# Altium project PowCapMobile.PrjPCB (part 1 of 3)
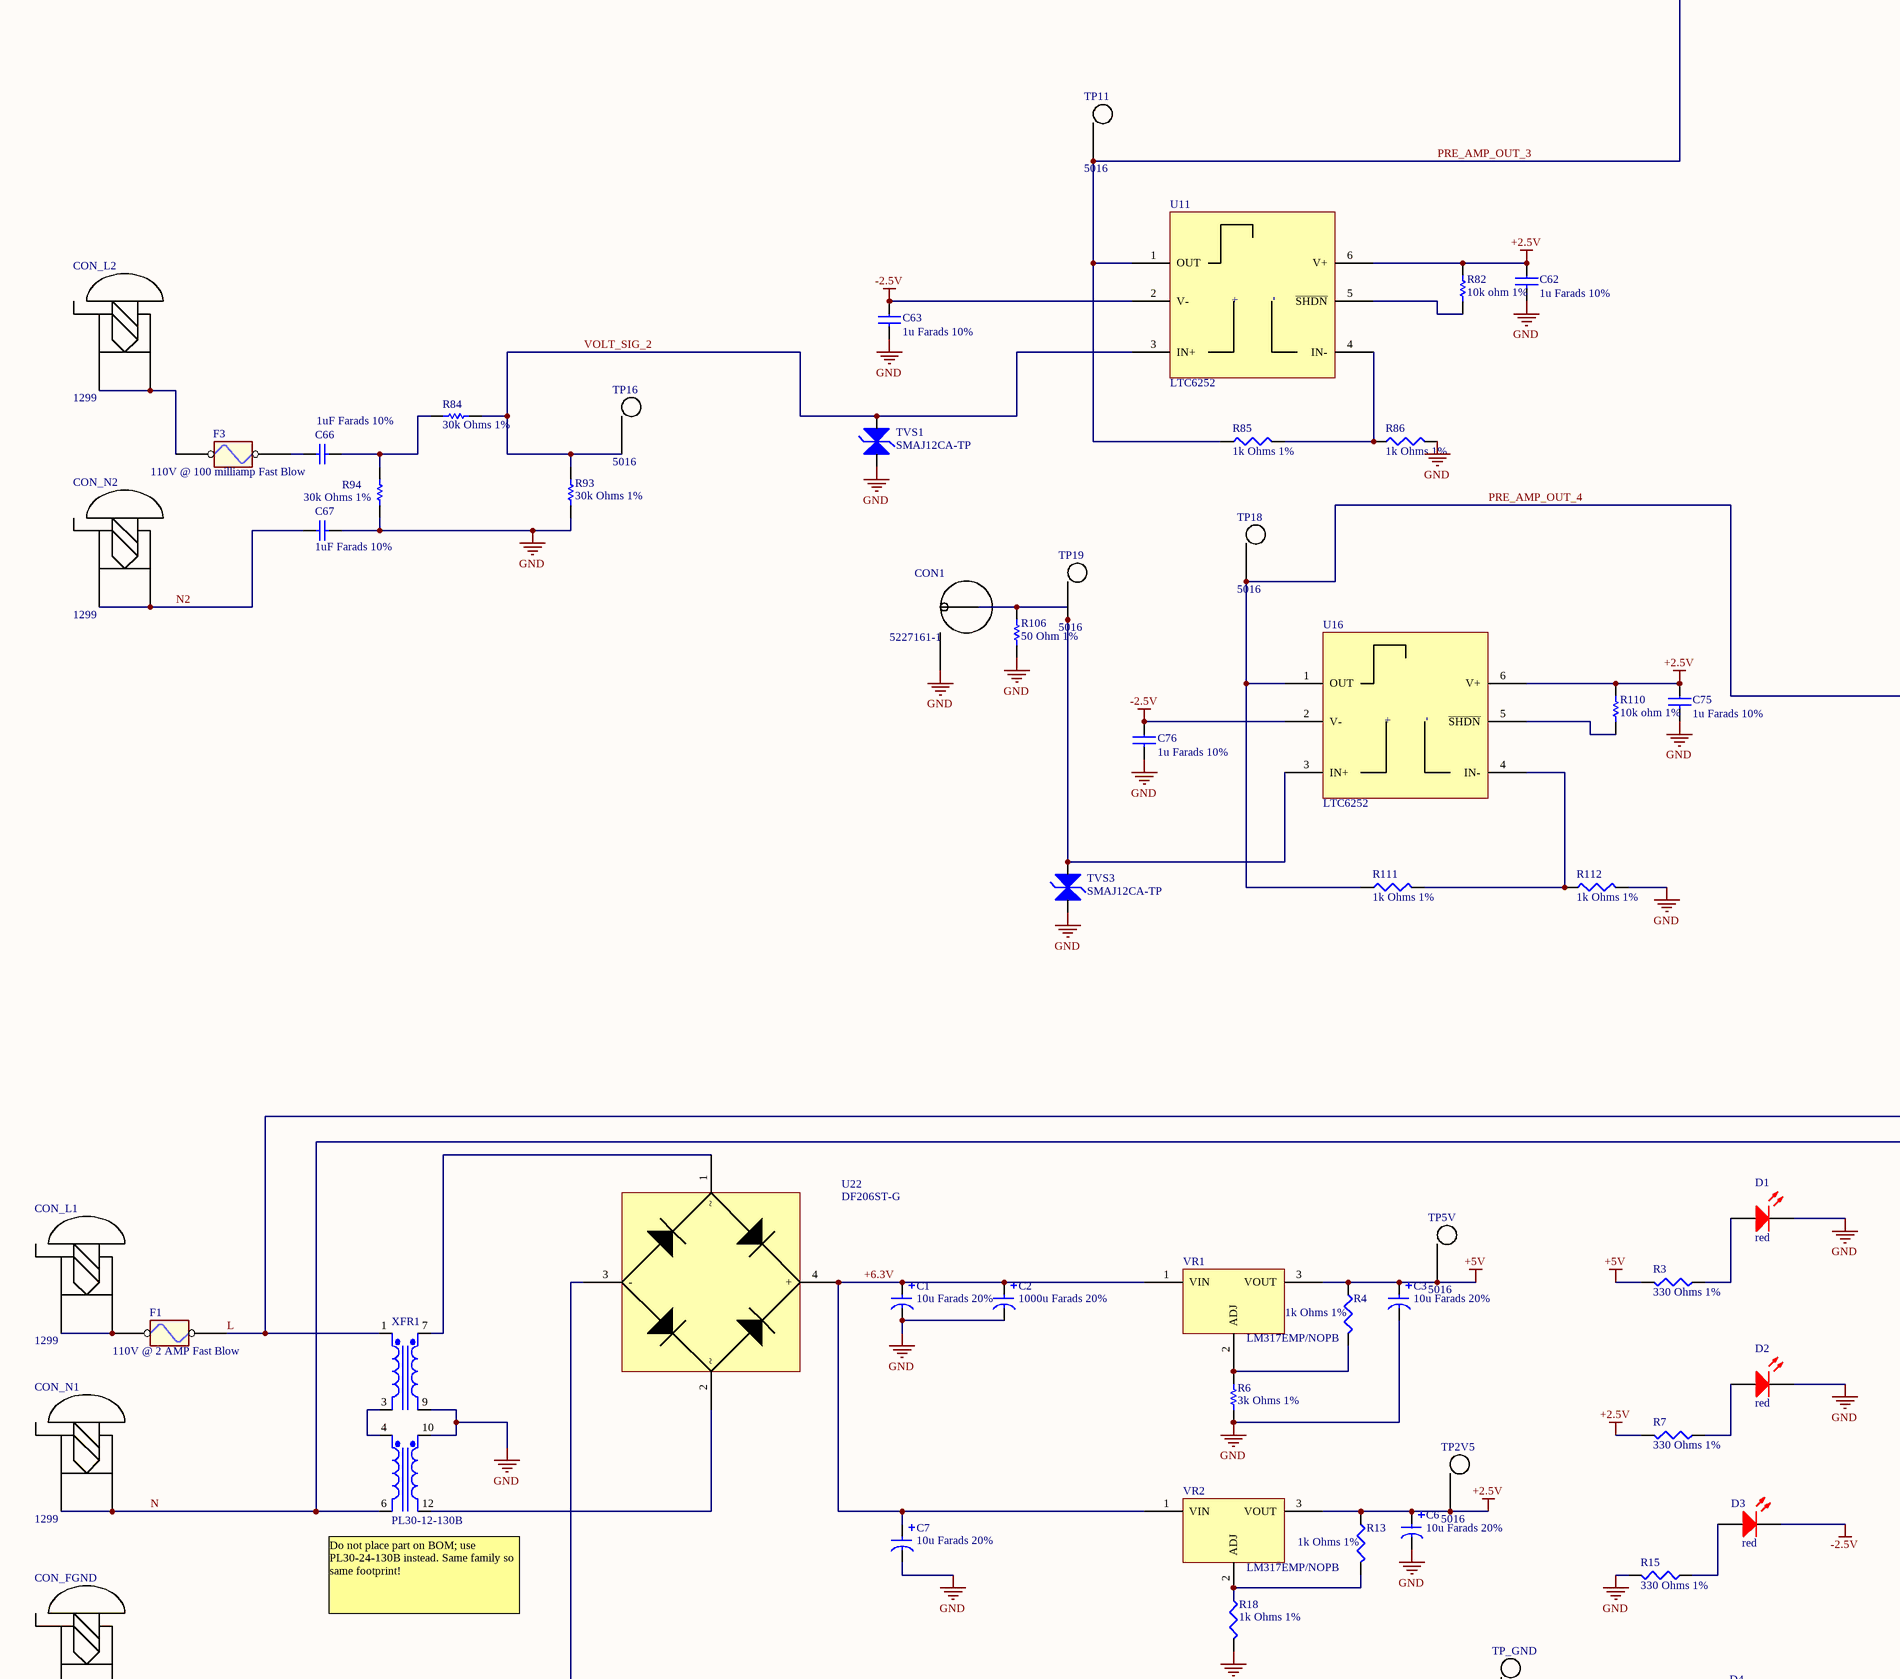
[diagram p0: PowCapMobile.SchDoc, top left]
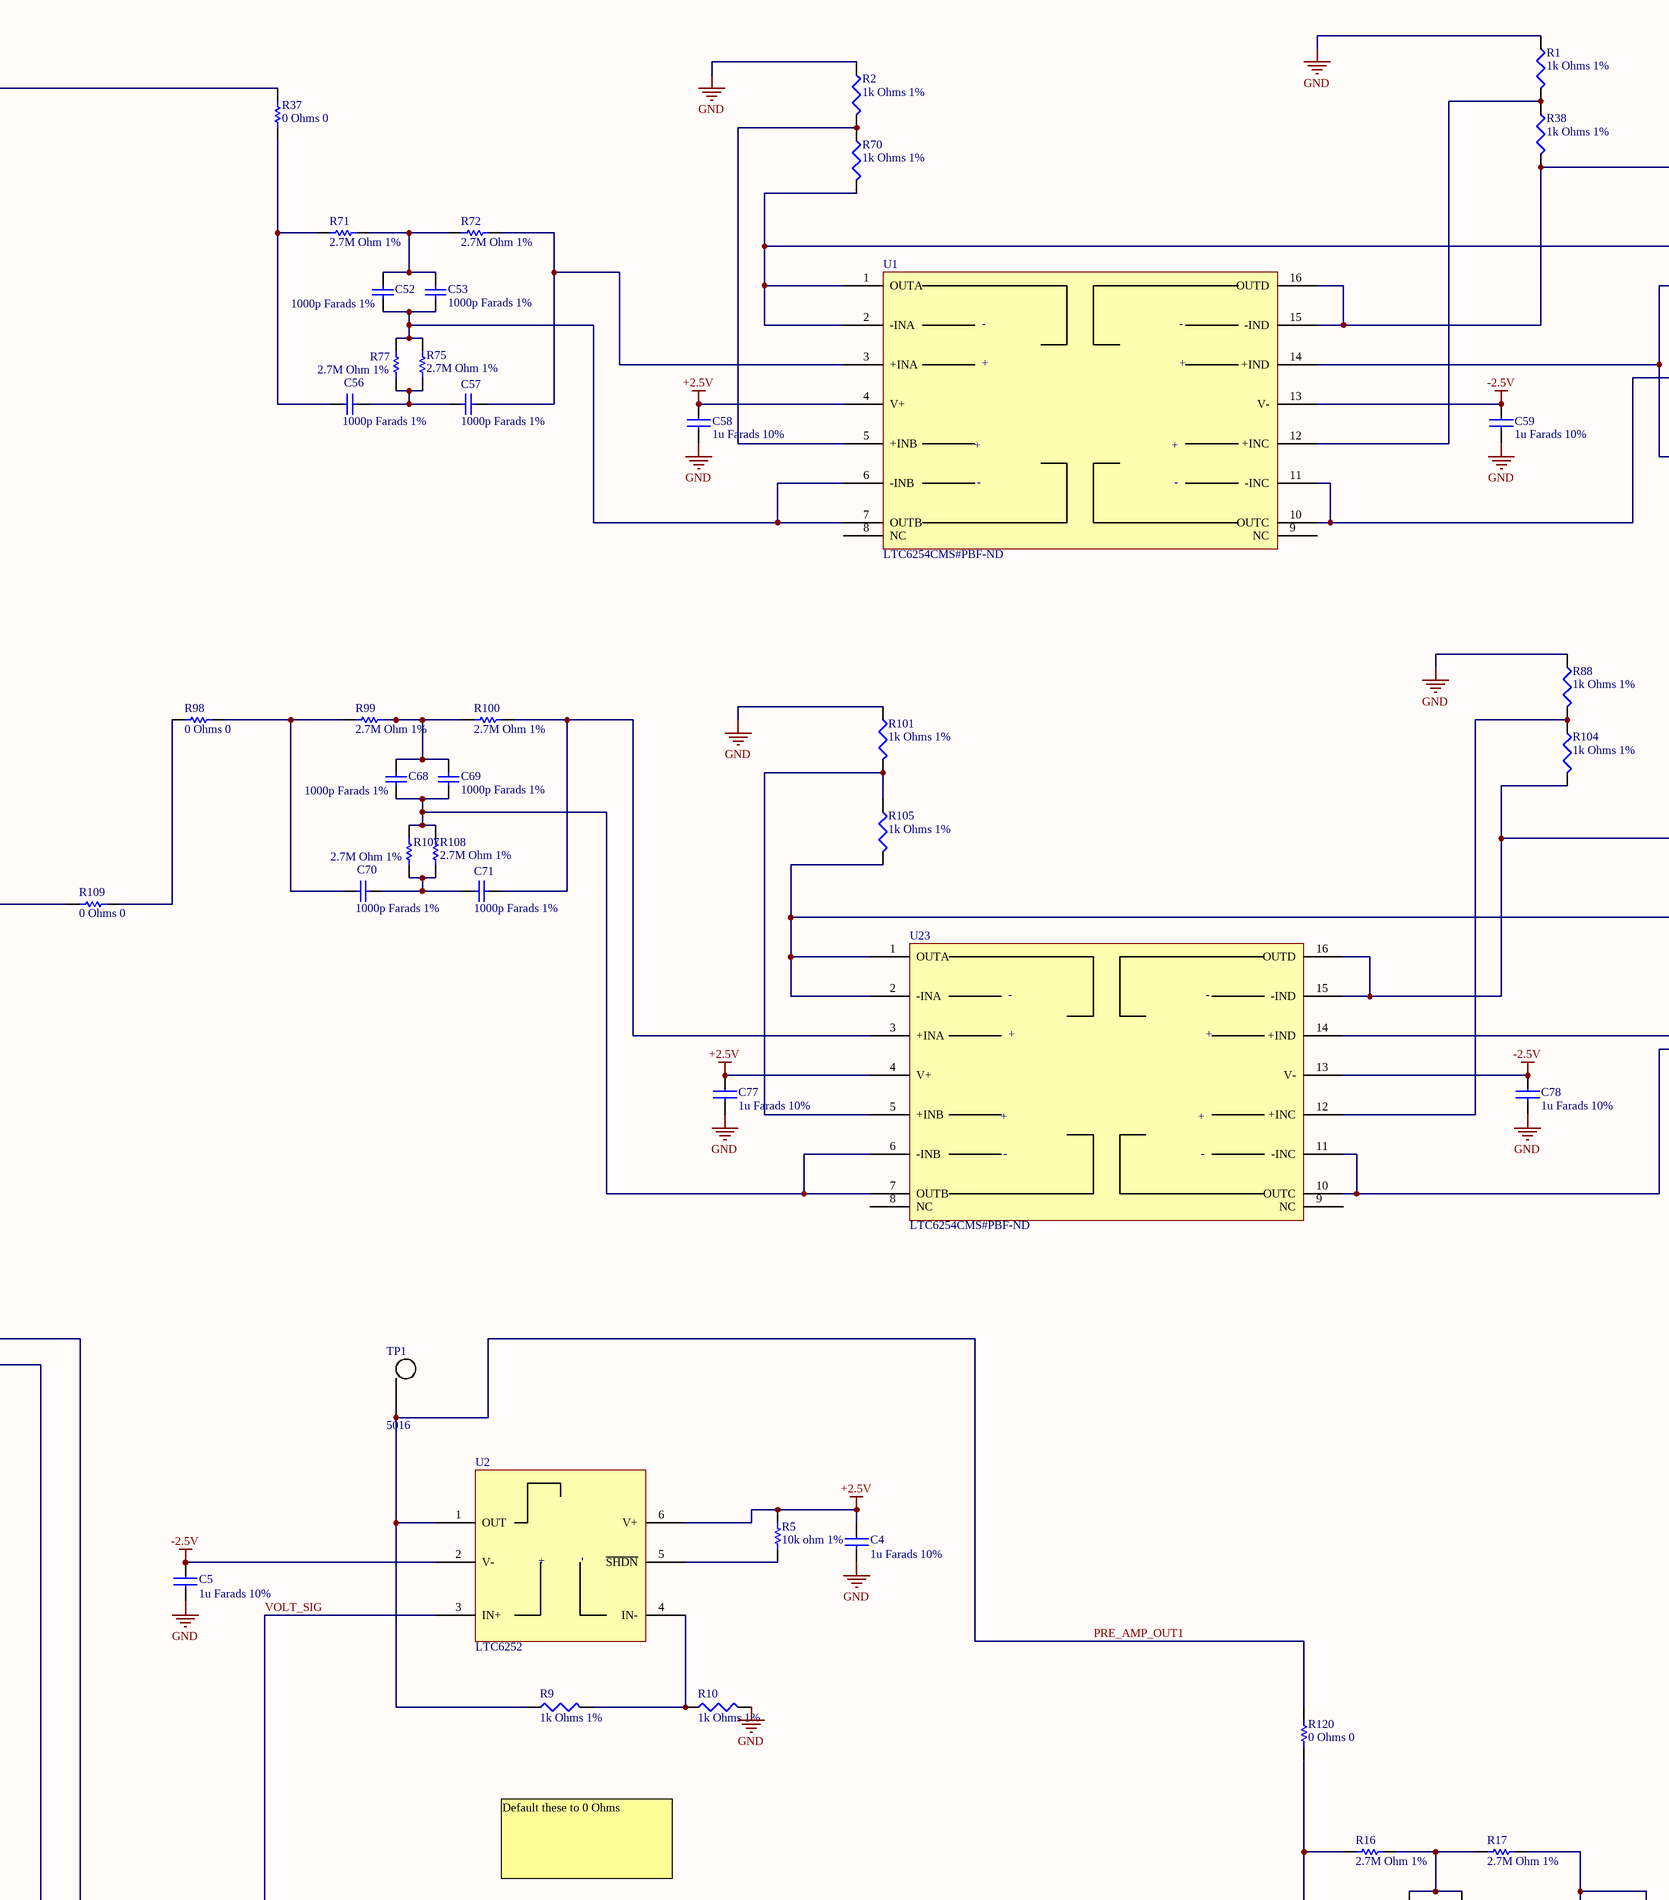
[diagram p1: PowCapMobile.SchDoc, top middle]
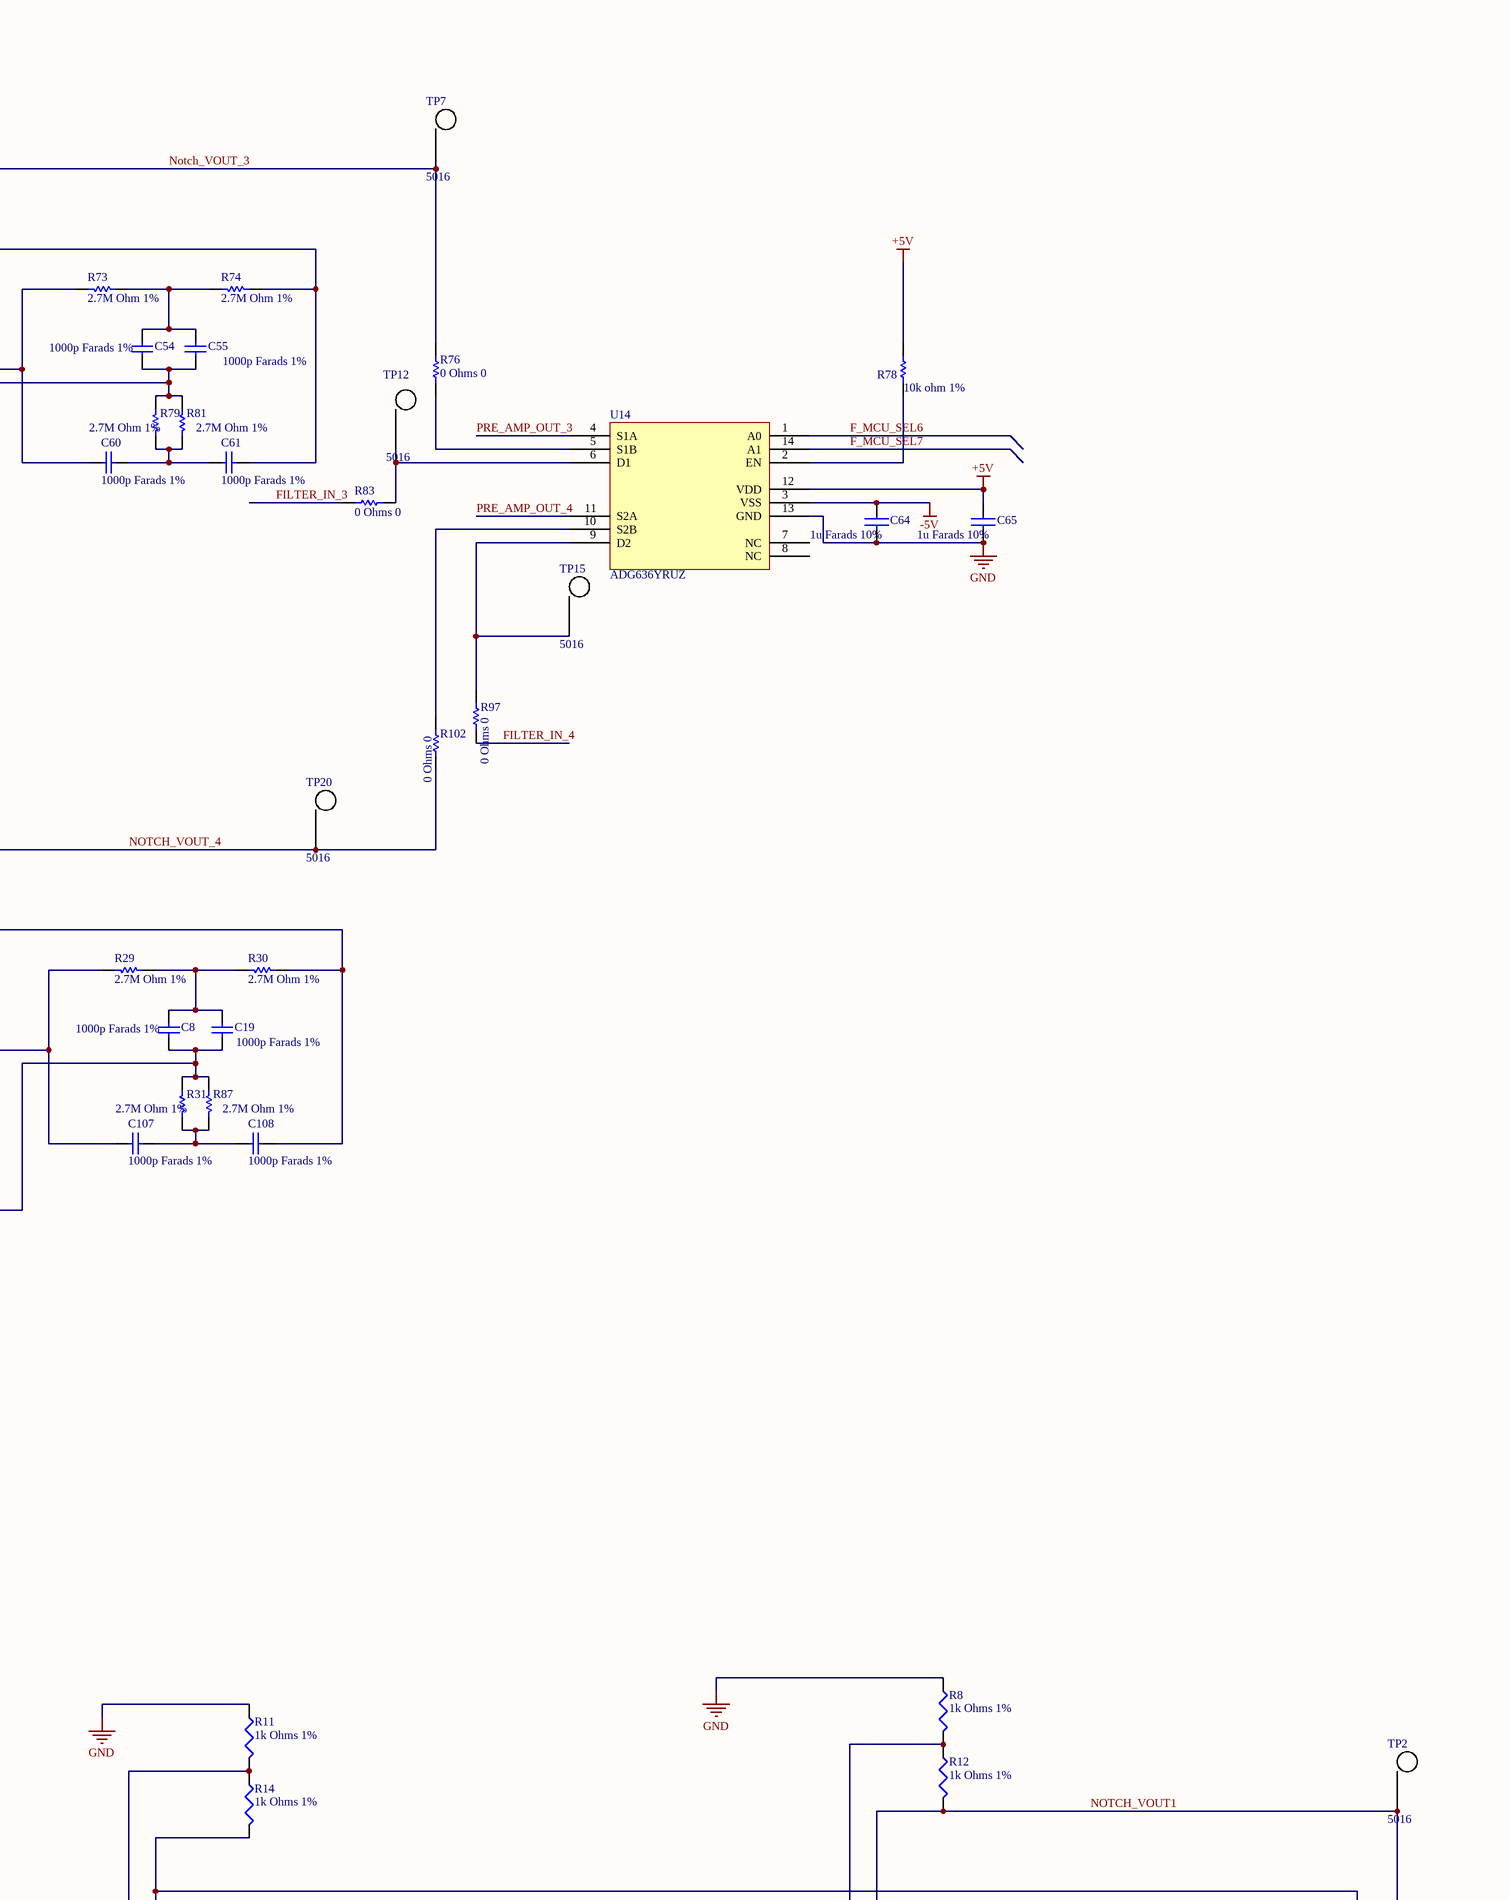
[diagram p2: PowCapMobile.SchDoc, top right]
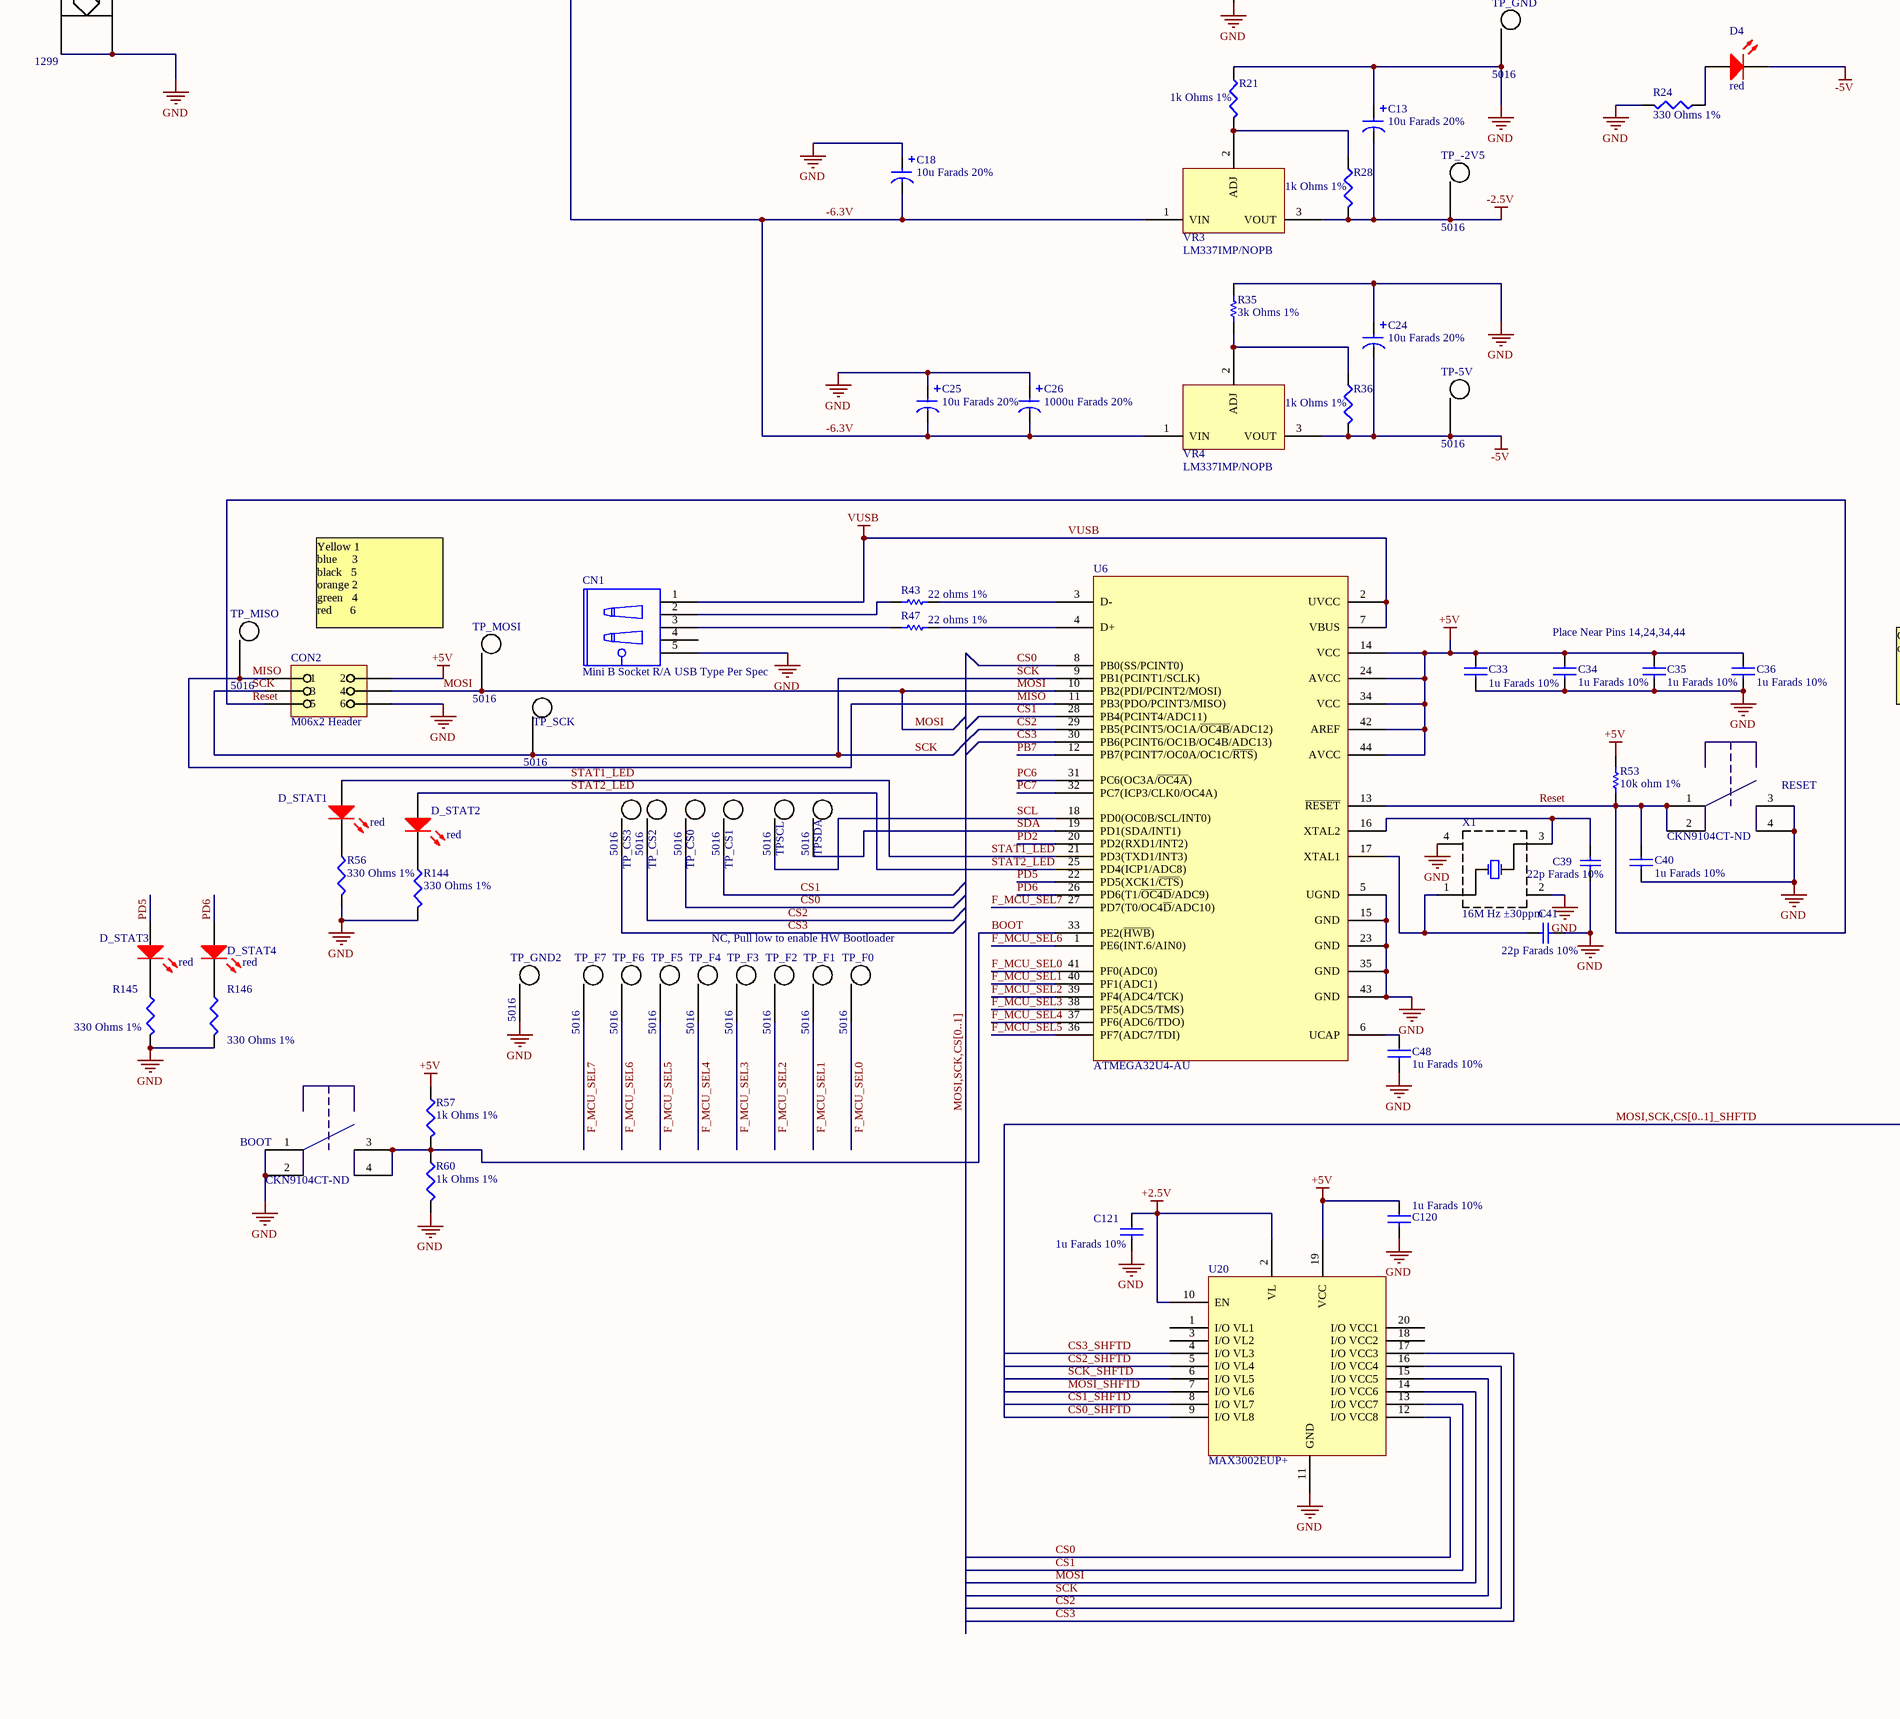
[diagram p3: PowCapMobile.SchDoc, centre left]
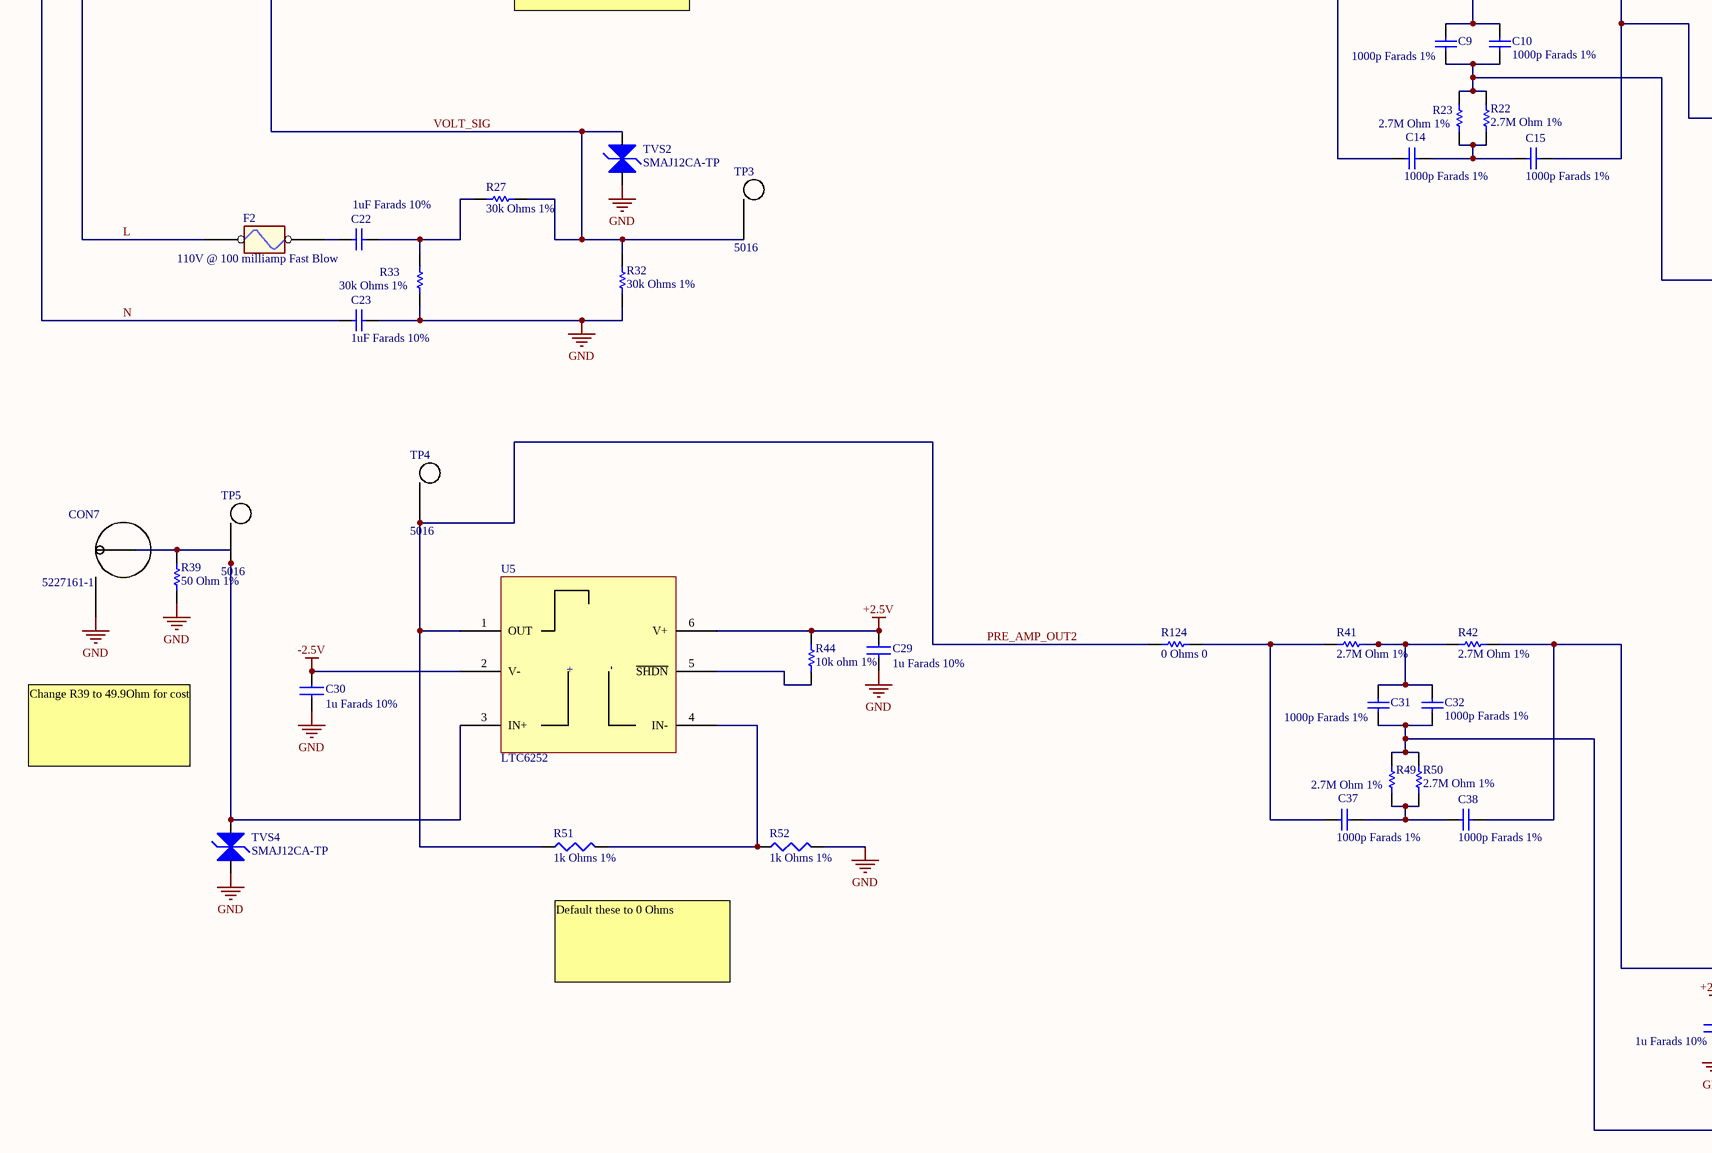
[diagram p4: PowCapMobile.SchDoc, centre middle]
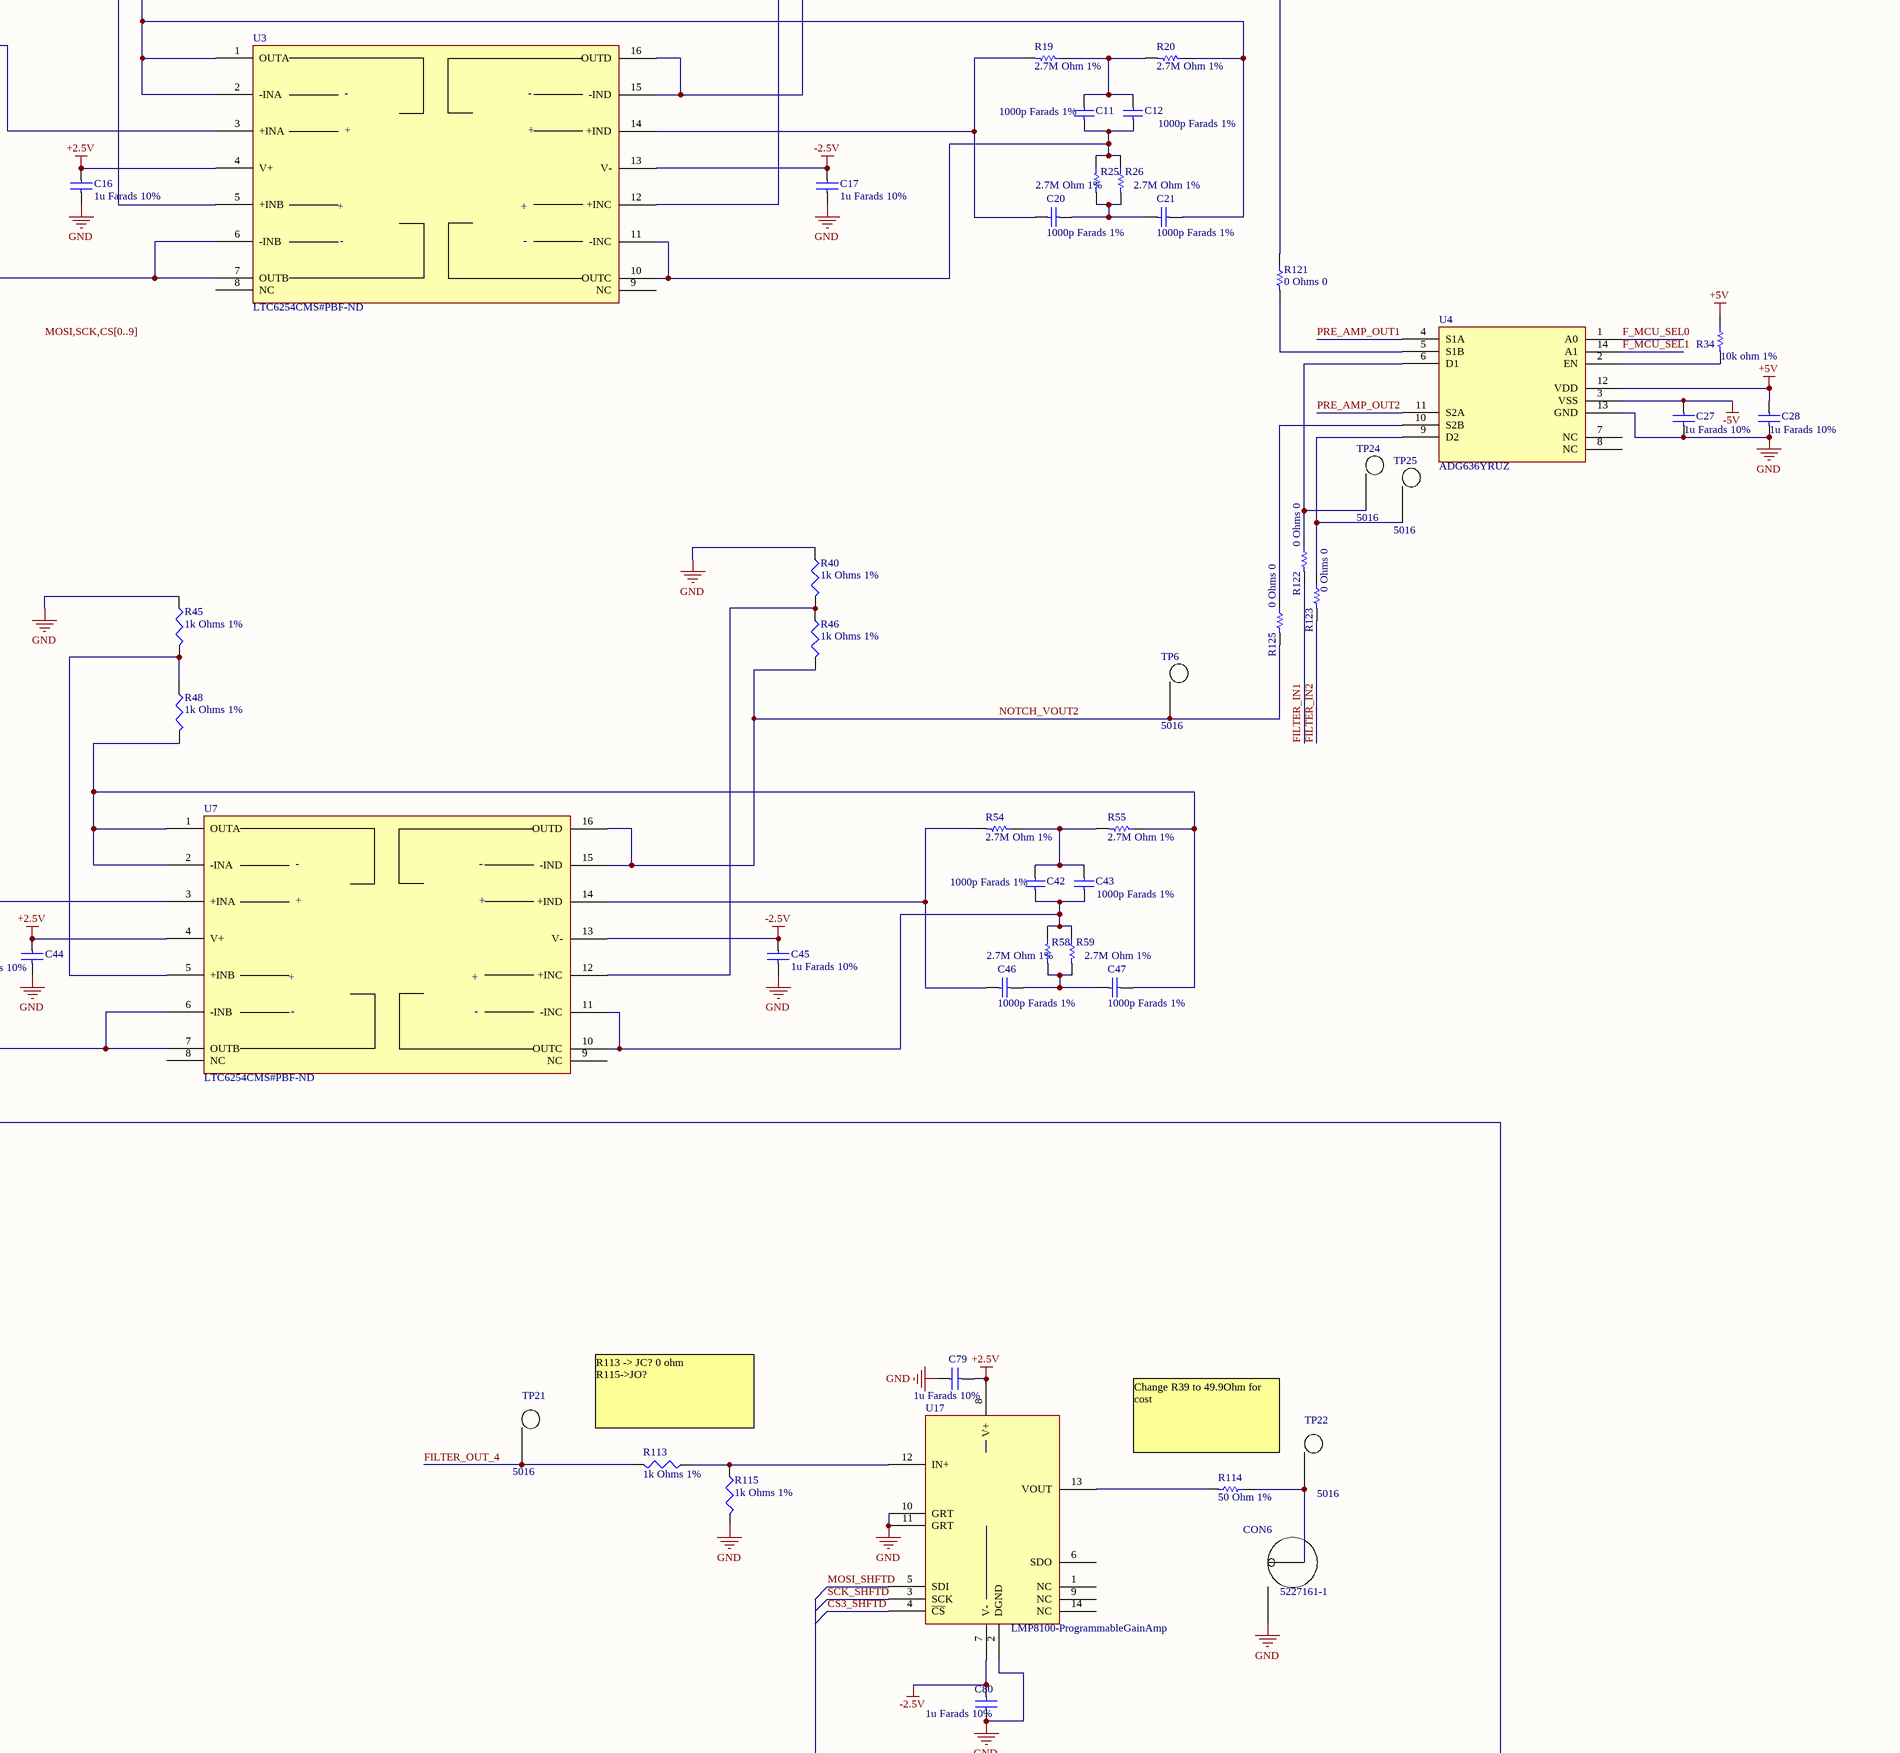
[diagram p5: PowCapMobile.SchDoc, centre right]
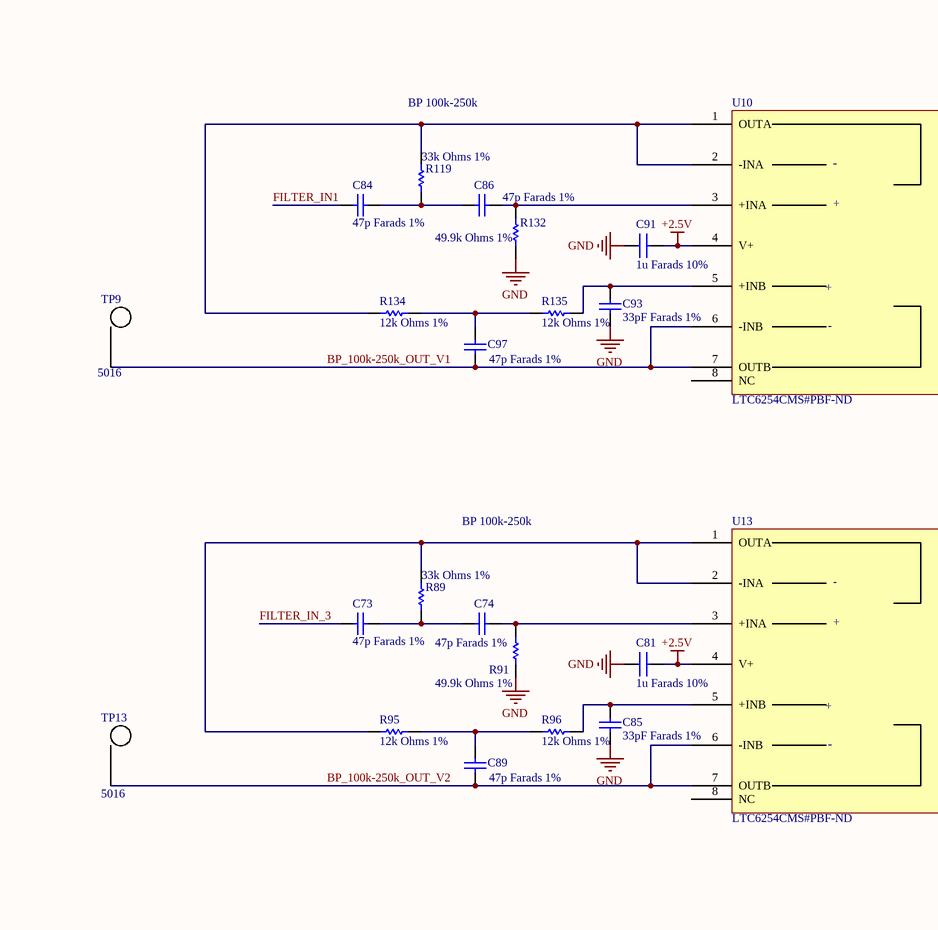
[diagram p6: PowCapMobile.SchDoc, bottom left]
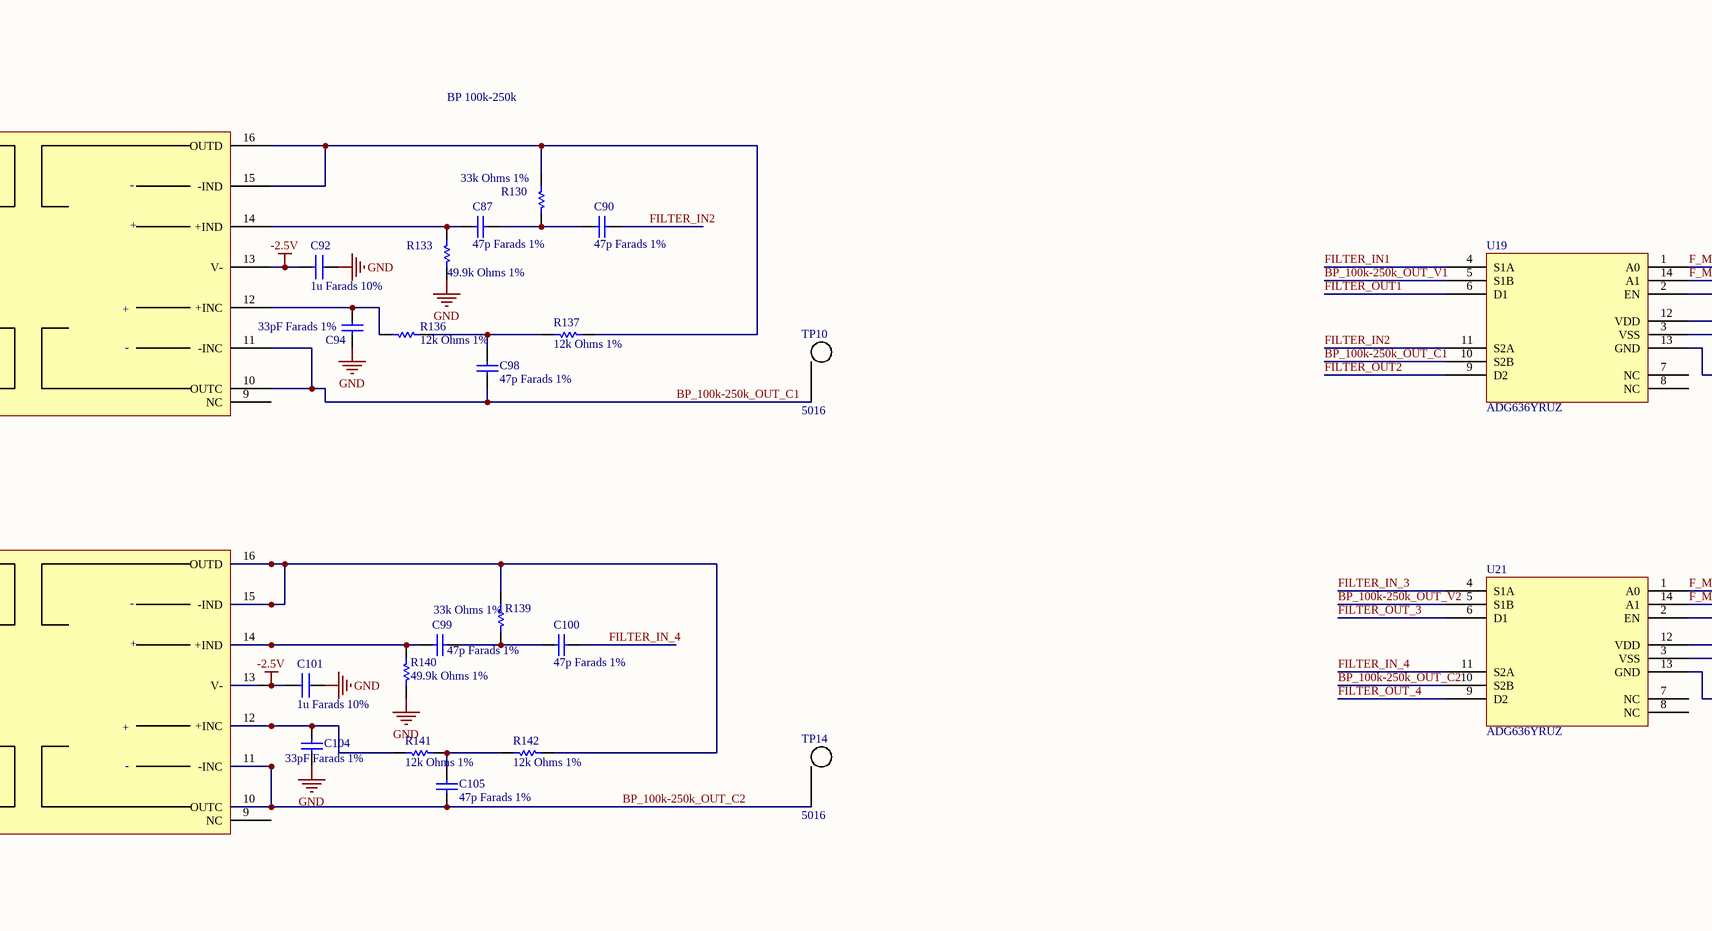
[diagram p7: PowCapMobile.SchDoc, bottom middle]
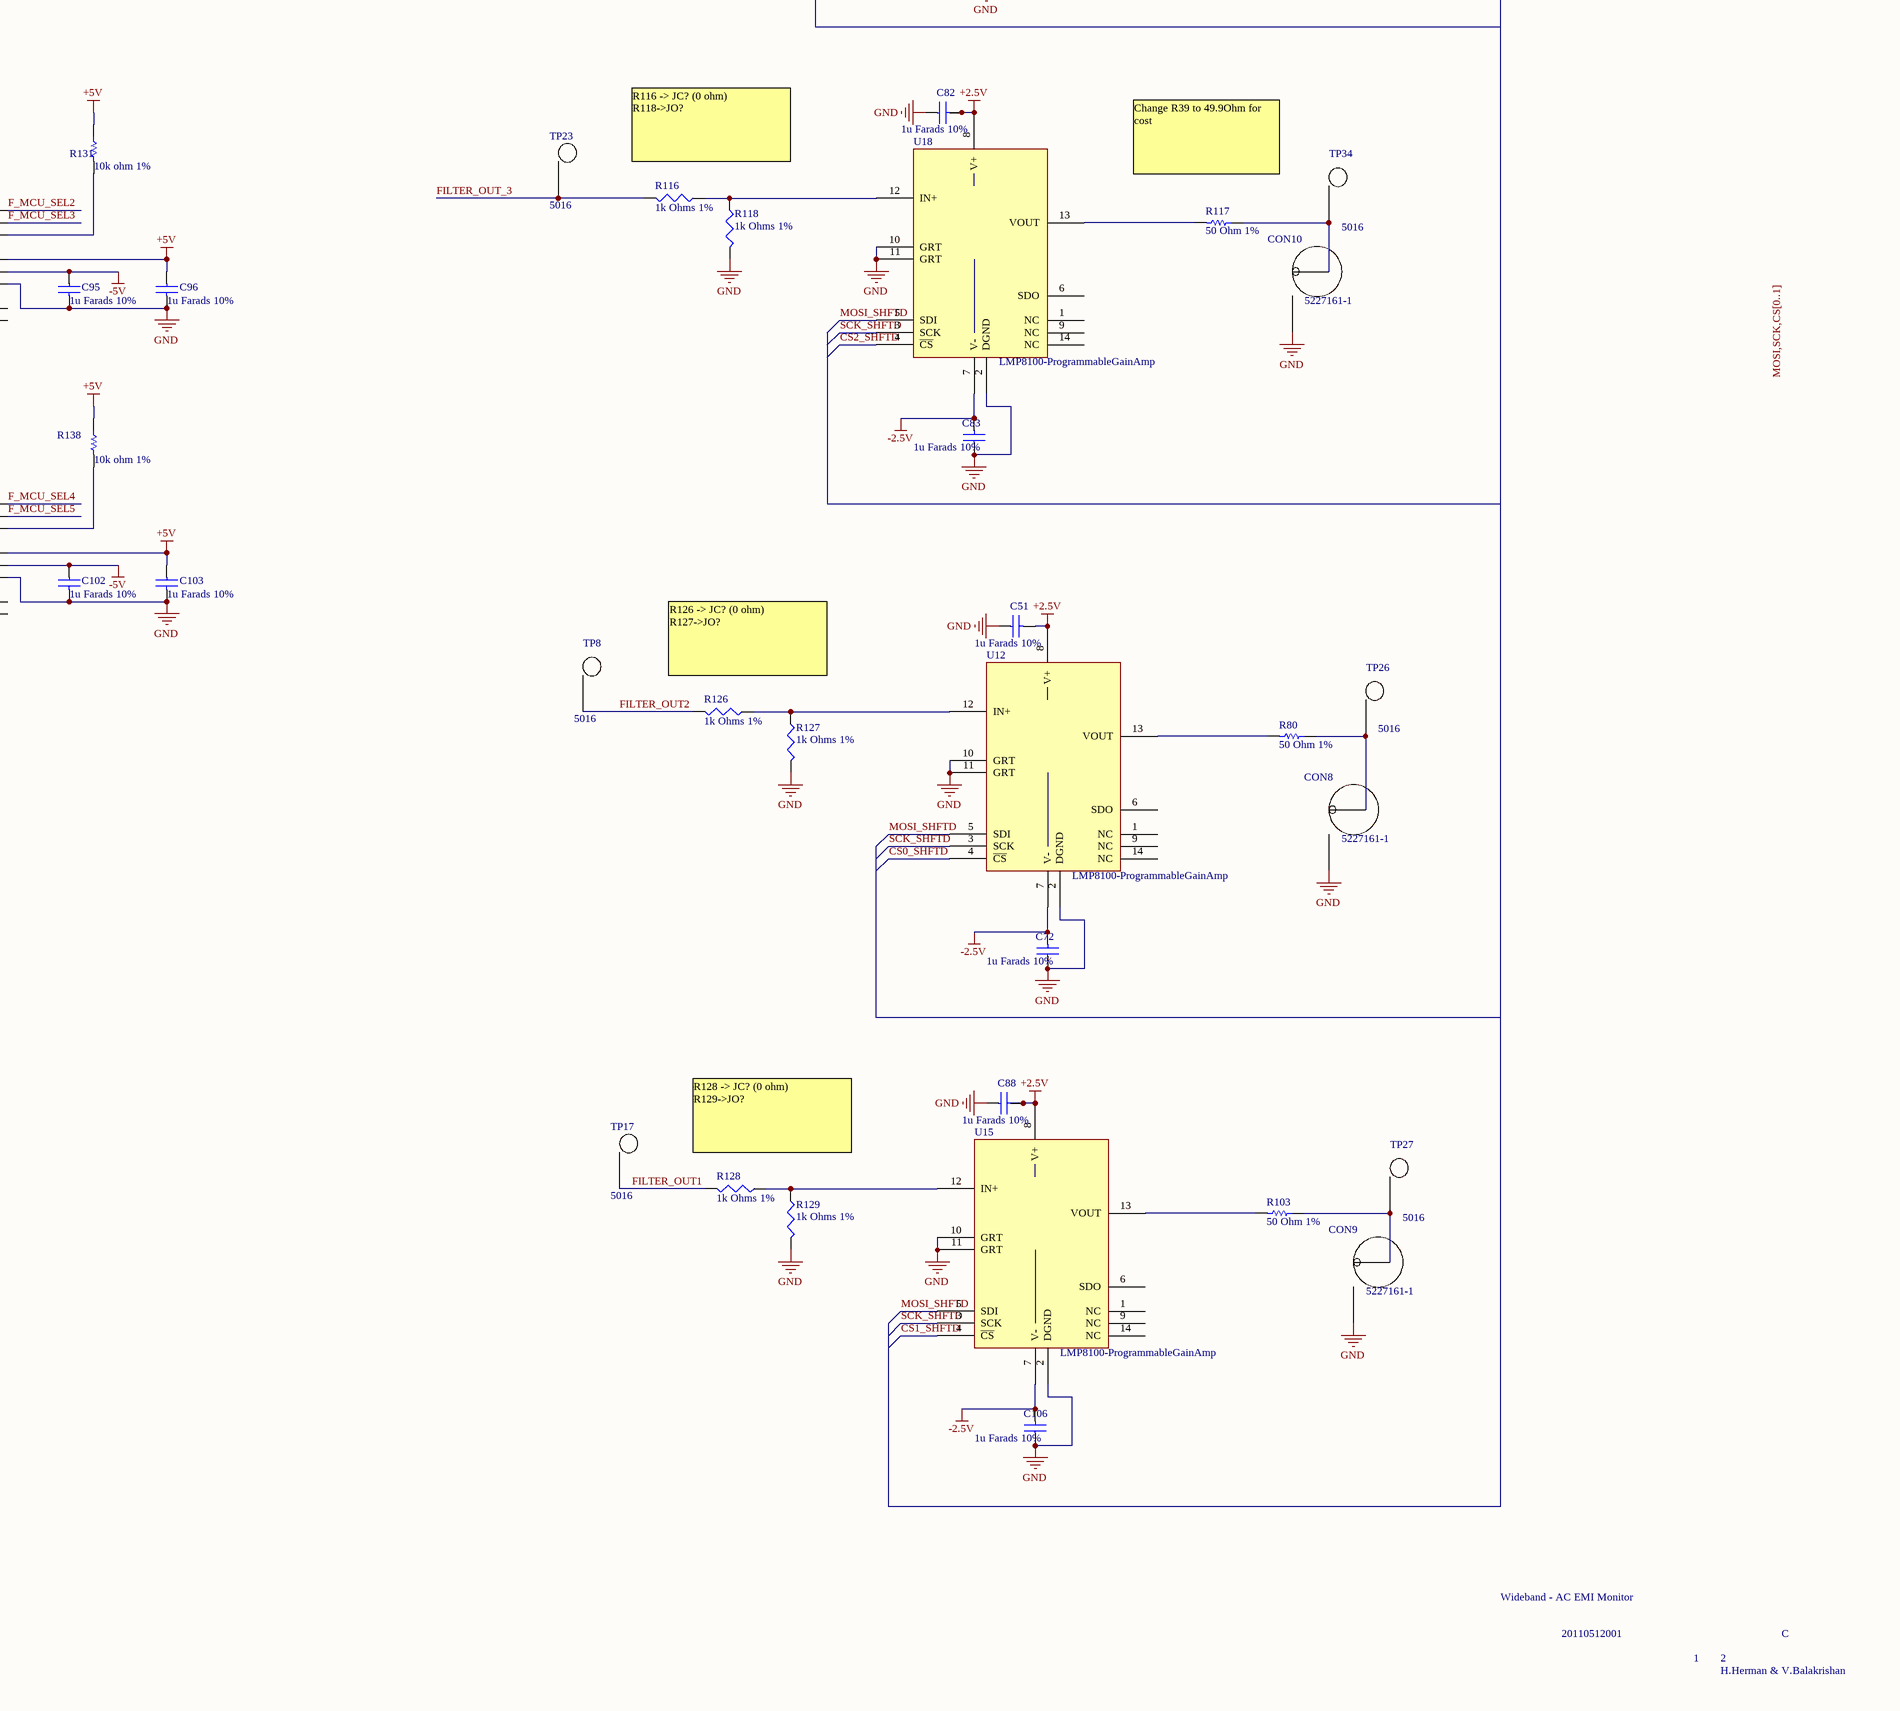
[diagram p8: PowCapMobile.SchDoc, bottom right]
1 sheet, 350 parts. Net scope: global (net labels, ports and power ports of the same name join across sheets).
Board file: PowCapMobile.PcbDoc

## Sheet PowCapMobile.SchDoc
size 1087 x 1087 mm

### Parts
BOOT  CKN9104CT-ND  [MOM-SW]
C1  10u Farads 20%  [CAP-SMD-POL-5mmDia]
C2  1000u Farads 20%  [CAP-CAN-SMD-POL-12.5mmDia]
C3  10u Farads 20%  [CAP-SMD-POL-5mmDia]
C4  1u Farads 10%  [SM/C_0603]
C5  1u Farads 10%  [SM/C_0603]
C6  10u Farads 20%  [CAP-SMD-POL-5mmDia]
C7  10u Farads 20%  [CAP-SMD-POL-5mmDia]
C8  1000p Farads 1%  [SM/C_0603]
C9  1000p Farads 1%  [SM/C_0603]
C10  1000p Farads 1%  [SM/C_0603]
C11  1000p Farads 1%  [SM/C_0603]
C12  1000p Farads 1%  [SM/C_0603]
C13  10u Farads 20%  [CAP-SMD-POL-5mmDia]
C14  1000p Farads 1%  [SM/C_0603]
C15  1000p Farads 1%  [SM/C_0603]
C16  1u Farads 10%  [SM/C_0603]
C17  1u Farads 10%  [SM/C_0603]
C18  10u Farads 20%  [CAP-SMD-POL-5mmDia]
C19  1000p Farads 1%  [SM/C_0603]
C20  1000p Farads 1%  [SM/C_0603]
C21  1000p Farads 1%  [SM/C_0603]
C22  1uF Farads 10%  [Y2-Caps-Epocs-1uF-10%]
C23  1uF Farads 10%  [Y2-Caps-Epocs-1uF-10%]
C24  10u Farads 20%  [CAP-SMD-POL-5mmDia]
C25  10u Farads 20%  [CAP-SMD-POL-5mmDia]
C26  1000u Farads 20%  [CAP-CAN-SMD-POL-12.5mmDia]
C27  1u Farads 10%  [SM/C_0603]
C28  1u Farads 10%  [SM/C_0603]
C29  1u Farads 10%  [SM/C_0603]
C30  1u Farads 10%  [SM/C_0603]
C31  1000p Farads 1%  [SM/C_0603]
C32  1000p Farads 1%  [SM/C_0603]
C33  1u Farads 10%  [SM/C_0603]
C34  1u Farads 10%  [SM/C_0603]
C35  1u Farads 10%  [SM/C_0603]
C36  1u Farads 10%  [SM/C_0603]
C37  1000p Farads 1%  [SM/C_0603]
C38  1000p Farads 1%  [SM/C_0603]
C39  22p Farads 10%  [SM/C_0603]
C40  1u Farads 10%  [SM/C_0603]
C41  22p Farads 10%  [SM/C_0603]
C42  1000p Farads 1%  [SM/C_0603]
C43  1000p Farads 1%  [SM/C_0603]
C44  1u Farads 10%  [SM/C_0603]
C45  1u Farads 10%  [SM/C_0603]
C46  1000p Farads 1%  [SM/C_0603]
C47  1000p Farads 1%  [SM/C_0603]
C48  1u Farads 10%  [SM/C_0603]
C51  1u Farads 10%  [SM/C_0603]
C52  1000p Farads 1%  [SM/C_0603]
C53  1000p Farads 1%  [SM/C_0603]
C54  1000p Farads 1%  [SM/C_0603]
C55  1000p Farads 1%  [SM/C_0603]
C56  1000p Farads 1%  [SM/C_0603]
C57  1000p Farads 1%  [SM/C_0603]
C58  1u Farads 10%  [SM/C_0603]
C59  1u Farads 10%  [SM/C_0603]
C60  1000p Farads 1%  [SM/C_0603]
C61  1000p Farads 1%  [SM/C_0603]
C62  1u Farads 10%  [SM/C_0603]
C63  1u Farads 10%  [SM/C_0603]
C64  1u Farads 10%  [SM/C_0603]
C65  1u Farads 10%  [SM/C_0603]
C66  1uF Farads 10%  [Y2-Caps-Epocs-1uF-10%]
C67  1uF Farads 10%  [Y2-Caps-Epocs-1uF-10%]
C68  1000p Farads 1%  [SM/C_0603]
C69  1000p Farads 1%  [SM/C_0603]
C70  1000p Farads 1%  [SM/C_0603]
C71  1000p Farads 1%  [SM/C_0603]
C72  1u Farads 10%  [SM/C_0603]
C73  47p Farads 1%  [SM/C_0603]
C74  47p Farads 1%  [SM/C_0603]
C75  1u Farads 10%  [SM/C_0603]
C76  1u Farads 10%  [SM/C_0603]
C77  1u Farads 10%  [SM/C_0603]
C78  1u Farads 10%  [SM/C_0603]
C79  1u Farads 10%  [SM/C_0603]
C80  1u Farads 10%  [SM/C_0603]
C81  1u Farads 10%  [SM/C_0603]
C82  1u Farads 10%  [SM/C_0603]
C83  1u Farads 10%  [SM/C_0603]
C84  47p Farads 1%  [SM/C_0603]
C85  33pF Farads 1%  [SM/C_0603]
C86  47p Farads 1%  [SM/C_0603]
C87  47p Farads 1%  [SM/C_0603]
C88  1u Farads 10%  [SM/C_0603]
C89  47p Farads 1%  [SM/C_0603]
C90  47p Farads 1%  [SM/C_0603]
C91  1u Farads 10%  [SM/C_0603]
C92  1u Farads 10%  [SM/C_0603]
C93  33pF Farads 1%  [SM/C_0603]
C94  33pF Farads 1%  [SM/C_0603]
C95  1u Farads 10%  [SM/C_0603]
C96  1u Farads 10%  [SM/C_0603]
C97  47p Farads 1%  [SM/C_0603]
C98  47p Farads 1%  [SM/C_0603]
C99  47p Farads 1%  [SM/C_0603]
C100  47p Farads 1%  [SM/C_0603]
C101  1u Farads 10%  [SM/C_0603]
C102  1u Farads 10%  [SM/C_0603]
C103  1u Farads 10%  [SM/C_0603]
C104  33pF Farads 1%  [SM/C_0603]
C105  47p Farads 1%  [SM/C_0603]
C106  1u Farads 10%  [SM/C_0603]
C107  1000p Farads 1%  [SM/C_0603]
C108  1000p Farads 1%  [SM/C_0603]
C120  1u Farads 10%  [SM/C_0603]
C121  1u Farads 10%  [SM/C_0603]
CN1  Mini B Socket R/A USB Type Per Spec  [MOLEX/54819-0579]
CON1  5227161-1  [BNC-RightAngle-PCB-50Ohm-Termination]
CON2  M06x2 Header  [6-pin 2mm]
CON6  5227161-1  [BNC-RightAngle-PCB-50Ohm-Termination]
CON7  5227161-1  [BNC-RightAngle-PCB-50Ohm-Termination]
CON8  5227161-1  [BNC-RightAngle-PCB-50Ohm-Termination]
CON9  5227161-1  [BNC-RightAngle-PCB-50Ohm-Termination]
CON10  5227161-1  [BNC-RightAngle-PCB-50Ohm-Termination]
CON_FGND  1299  [LOW-PROFILE-SCREWTERMINAL]
CON_L1  1299  [LOW-PROFILE-SCREWTERMINAL]
CON_L2  1299  [LOW-PROFILE-SCREWTERMINAL]
CON_N1  1299  [LOW-PROFILE-SCREWTERMINAL]
CON_N2  1299  [LOW-PROFILE-SCREWTERMINAL]
D1  red  [LITEON/LED/0603]
D2  red  [LITEON/LED/0603]
D3  red  [LITEON/LED/0603]
D4  red  [LITEON/LED/0603]
D_STAT1  red  [LITEON/LED/0603]
D_STAT2  red  [LITEON/LED/0603]
D_STAT3  red  [LITEON/LED/0603]
D_STAT4  red  [LITEON/LED/0603]
F1  110V @ 2 AMP Fast Blow  [WICKMANN/WK0011-ND]
F2  110V @ 100 milliamp Fast Blow  [WICKMANN/WK0011-ND]
F3  110V @ 100 milliamp Fast Blow  [WICKMANN/WK0011-ND]
R1  1k Ohms 1%  [SM/C_0603]
R2  1k Ohms 1%  [SM/C_0603]
R3  330 Ohms 1%  [SM/C_0603]
R4  1k Ohms 1%  [SM/C_0603]
R5  10k ohm 1%  [SM/C_0603]
R6  3k Ohms 1%  [SM/C_0603]
R7  330 Ohms 1%  [SM/C_0603]
R8  1k Ohms 1%  [SM/C_0603]
R9  1k Ohms 1%  [SM/C_0603]
R10  1k Ohms 1%  [SM/C_0603]
R11  1k Ohms 1%  [SM/C_0603]
R12  1k Ohms 1%  [SM/C_0603]
R13  1k Ohms 1%  [SM/C_0603]
R14  1k Ohms 1%  [SM/C_0603]
R15  330 Ohms 1%  [SM/C_0603]
R16  2.7M Ohm 1%  [SM/R_0603]
R17  2.7M Ohm 1%  [SM/R_0603]
R18  1k Ohms 1%  [SM/C_0603]
R19  2.7M Ohm 1%  [SM/R_0603]
R20  2.7M Ohm 1%  [SM/R_0603]
R21  1k Ohms 1%  [SM/C_0603]
R22  2.7M Ohm 1%  [SM/R_0603]
R23  2.7M Ohm 1%  [SM/R_0603]
R24  330 Ohms 1%  [SM/C_0603]
R25  2.7M Ohm 1%  [SM/R_0603]
R26  2.7M Ohm 1%  [SM/R_0603]
R27  30k Ohms 1%  [Resistor-3.2mm x 1.70mm]
R28  1k Ohms 1%  [SM/C_0603]
R29  2.7M Ohm 1%  [SM/R_0603]
R30  2.7M Ohm 1%  [SM/R_0603]
R31  2.7M Ohm 1%  [SM/R_0603]
R32  30k Ohms 1%  [Resistor-3.2mm x 1.70mm]
R33  30k Ohms 1%  [Resistor-3.2mm x 1.70mm]
R34  10k ohm 1%  [SM/C_0603]
R35  3k Ohms 1%  [SM/C_0603]
R36  1k Ohms 1%  [SM/C_0603]
R37  0 Ohms 0  [SM/R_0603]
R38  1k Ohms 1%  [SM/C_0603]
R39  50 Ohm 1%  [SM/R_0603]
R40  1k Ohms 1%  [SM/C_0603]
R41  2.7M Ohm 1%  [SM/R_0603]
R42  2.7M Ohm 1%  [SM/R_0603]
R43  22 ohms 1%  [SM/C_0603]
R44  10k ohm 1%  [SM/C_0603]
R45  1k Ohms 1%  [SM/C_0603]
R46  1k Ohms 1%  [SM/C_0603]
R47  22 ohms 1%  [SM/C_0603]
R48  1k Ohms 1%  [SM/C_0603]
R49  2.7M Ohm 1%  [SM/R_0603]
R50  2.7M Ohm 1%  [SM/R_0603]
R51  1k Ohms 1%  [SM/C_0603]
R52  1k Ohms 1%  [SM/C_0603]
R53  10k ohm 1%  [SM/C_0603]
R54  2.7M Ohm 1%  [SM/R_0603]
R55  2.7M Ohm 1%  [SM/R_0603]
R56  330 Ohms 1%  [SM/C_0603]
R57  1k Ohms 1%  [SM/C_0603]
R58  2.7M Ohm 1%  [SM/R_0603]
R59  2.7M Ohm 1%  [SM/R_0603]
R60  1k Ohms 1%  [SM/C_0603]
R70  1k Ohms 1%  [SM/C_0603]
R71  2.7M Ohm 1%  [SM/R_0603]
R72  2.7M Ohm 1%  [SM/R_0603]
R73  2.7M Ohm 1%  [SM/R_0603]
R74  2.7M Ohm 1%  [SM/R_0603]
R75  2.7M Ohm 1%  [SM/R_0603]
R76  0 Ohms 0  [SM/R_0603]
R77  2.7M Ohm 1%  [SM/R_0603]
R78  10k ohm 1%  [SM/C_0603]
R79  2.7M Ohm 1%  [SM/R_0603]
R80  50 Ohm 1%  [SM/R_0603]
R81  2.7M Ohm 1%  [SM/R_0603]
R82  10k ohm 1%  [SM/C_0603]
R83  0 Ohms 0  [SM/R_0603]
R84  30k Ohms 1%  [Resistor-3.2mm x 1.70mm]
R85  1k Ohms 1%  [SM/C_0603]
R86  1k Ohms 1%  [SM/C_0603]
R87  2.7M Ohm 1%  [SM/R_0603]
R88  1k Ohms 1%  [SM/C_0603]
R89  33k Ohms 1%  [SM/R_0603]
R91  49.9k Ohms 1%  [SM/R_0603]
R93  30k Ohms 1%  [Resistor-3.2mm x 1.70mm]
R94  30k Ohms 1%  [Resistor-3.2mm x 1.70mm]
R95  12k Ohms 1%  [SM/R_0603]
R96  12k Ohms 1%  [SM/R_0603]
R97  0 Ohms 0  [SM/R_0603]
R98  0 Ohms 0  [SM/R_0603]
R99  2.7M Ohm 1%  [SM/R_0603]
R100  2.7M Ohm 1%  [SM/R_0603]
R101  1k Ohms 1%  [SM/C_0603]
R102  0 Ohms 0  [SM/R_0603]
R103  50 Ohm 1%  [SM/R_0603]
R104  1k Ohms 1%  [SM/C_0603]
R105  1k Ohms 1%  [SM/C_0603]
R106  50 Ohm 1%  [SM/R_0603]
R107  2.7M Ohm 1%  [SM/R_0603]
R108  2.7M Ohm 1%  [SM/R_0603]
R109  0 Ohms 0  [SM/R_0603]
R110  10k ohm 1%  [SM/C_0603]
R111  1k Ohms 1%  [SM/C_0603]
R112  1k Ohms 1%  [SM/C_0603]
R113  1k Ohms 1%  [SM/C_0603]
R114  50 Ohm 1%  [SM/R_0603]
R115  1k Ohms 1%  [SM/C_0603]
R116  1k Ohms 1%  [SM/C_0603]
R117  50 Ohm 1%  [SM/R_0603]
R118  1k Ohms 1%  [SM/C_0603]
R119  33k Ohms 1%  [SM/R_0603]
R120  0 Ohms 0  [SM/R_0603]
R121  0 Ohms 0  [SM/R_0603]
R122  0 Ohms 0  [SM/R_0603]
R123  0 Ohms 0  [SM/R_0603]
R124  0 Ohms 0  [SM/R_0603]
R125  0 Ohms 0  [SM/R_0603]
R126  1k Ohms 1%  [SM/C_0603]
R127  1k Ohms 1%  [SM/C_0603]
R128  1k Ohms 1%  [SM/C_0603]
R129  1k Ohms 1%  [SM/C_0603]
R130  33k Ohms 1%  [SM/R_0603]
R131  10k ohm 1%  [SM/C_0603]
R132  49.9k Ohms 1%  [SM/R_0603]
R133  49.9k Ohms 1%  [SM/R_0603]
R134  12k Ohms 1%  [SM/R_0603]
R135  12k Ohms 1%  [SM/R_0603]
R136  12k Ohms 1%  [SM/R_0603]
R137  12k Ohms 1%  [SM/R_0603]
R138  10k ohm 1%  [SM/C_0603]
R139  33k Ohms 1%  [SM/R_0603]
R140  49.9k Ohms 1%  [SM/R_0603]
R141  12k Ohms 1%  [SM/R_0603]
R142  12k Ohms 1%  [SM/R_0603]
R144  330 Ohms 1%  [SM/C_0603]
R145  330 Ohms 1%  [SM/C_0603]
R146  330 Ohms 1%  [SM/C_0603]
RESET  CKN9104CT-ND  [MOM-SW]
TP1  5016  [TEST_PT_SMD]
TP2  5016  [TEST_PT_SMD]
TP2V5  5016  [TEST_PT_SMD]
TP3  5016  [TEST_PT_SMD]
TP4  5016  [TEST_PT_SMD]
TP5  5016  [TEST_PT_SMD]
TP5V  5016  [TEST_PT_SMD]
TP6  5016  [TEST_PT_SMD]
TP7  5016  [TEST_PT_SMD]
TP8  5016  [TEST_PT_SMD]
TP9  5016  [TEST_PT_SMD]
TP10  5016  [TEST_PT_SMD]
TP11  5016  [TEST_PT_SMD]
TP12  5016  [TEST_PT_SMD]
TP13  5016  [TEST_PT_SMD]
TP14  5016  [TEST_PT_SMD]
TP15  5016  [TEST_PT_SMD]
TP16  5016  [TEST_PT_SMD]
TP17  5016  [TEST_PT_SMD]
TP18  5016  [TEST_PT_SMD]
TP19  5016  [TEST_PT_SMD]
TP20  5016  [TEST_PT_SMD]
TP21  5016  [TEST_PT_SMD]
TP22  5016  [TEST_PT_SMD]
TP23  5016  [TEST_PT_SMD]
TP24  5016  [TEST_PT_SMD]
TP25  5016  [TEST_PT_SMD]
TP26  5016  [TEST_PT_SMD]
TP27  5016  [TEST_PT_SMD]
TP34  5016  [TEST_PT_SMD]
TP-5V  5016  [TEST_PT_SMD]
TP_-2V5  5016  [TEST_PT_SMD]
TP_CS0  5016  [TEST_PT_SMD]
TP_CS1  5016  [TEST_PT_SMD]
TP_CS2  5016  [TEST_PT_SMD]
TP_CS3  5016  [TEST_PT_SMD]
TP_F0  5016  [TEST_PT_SMD]
TP_F1  5016  [TEST_PT_SMD]
TP_F2  5016  [TEST_PT_SMD]
TP_F3  5016  [TEST_PT_SMD]
TP_F4  5016  [TEST_PT_SMD]
TP_F5  5016  [TEST_PT_SMD]
TP_F6  5016  [TEST_PT_SMD]
TP_F7  5016  [TEST_PT_SMD]
TP_GND  5016  [TEST_PT_SMD]
TP_GND2  5016  [TEST_PT_SMD]
TP_MISO  5016  [TEST_PT_SMD]
TP_MOSI  5016  [TEST_PT_SMD]
TP_SCK  5016  [TEST_PT_SMD]
TPSCL  5016  [TEST_PT_SMD]
TPSDA  5016  [TEST_PT_SMD]
TVS1  SMAJ12CA-TP  [D0-214AC]
TVS2  SMAJ12CA-TP  [D0-214AC]
TVS3  SMAJ12CA-TP  [D0-214AC]
TVS4  SMAJ12CA-TP  [D0-214AC]
U1  LTC6254CMS#PBF-ND  [MSOP-16Lead-LTC6254]
U2  LTC6252  [TSOT-23-LTC6252-OpAmp]
U3  LTC6254CMS#PBF-ND  [MSOP-16Lead-LTC6254]
U4  ADG636YRUZ  [TSSOP-14Lead-AnalogDevices-ADG636]
U5  LTC6252  [TSOT-23-LTC6252-OpAmp]
U6  ATMEGA32U4-AU  [TQFP80P1200X1200X120-44L]
U7  LTC6254CMS#PBF-ND  [MSOP-16Lead-LTC6254]
U10  LTC6254CMS#PBF-ND  [MSOP-16Lead-LTC6254]
U11  LTC6252  [TSOT-23-LTC6252-OpAmp]
U12  LMP8100-ProgrammableGainAmp  [SOIC-14pin-National-Semiconductor]
U13  LTC6254CMS#PBF-ND  [MSOP-16Lead-LTC6254]
U14  ADG636YRUZ  [TSSOP-14Lead-AnalogDevices-ADG636]
U15  LMP8100-ProgrammableGainAmp  [SOIC-14pin-National-Semiconductor]
U16  LTC6252  [TSOT-23-LTC6252-OpAmp]
U17  LMP8100-ProgrammableGainAmp  [SOIC-14pin-National-Semiconductor]
U18  LMP8100-ProgrammableGainAmp  [SOIC-14pin-National-Semiconductor]
U19  ADG636YRUZ  [TSSOP-14Lead-AnalogDevices-ADG636]
U20  MAX3002EUP+  [TSSOP-20Lead-MAXIM]
U21  ADG636YRUZ  [TSSOP-14Lead-AnalogDevices-ADG636]
U22  DF206ST-G  [BridgeRectifier-DFS]
U23  LTC6254CMS#PBF-ND  [MSOP-16Lead-LTC6254]
VR1  LM317EMP/NOPB  [LM317-SOT233-POS-ADJ-VOLT_REG]
VR2  LM317EMP/NOPB  [LM317-SOT233-POS-ADJ-VOLT_REG]
VR3  LM337IMP/NOPB  [LM337-ADJ-NEG-VOLT-REG]
VR4  LM337IMP/NOPB  [LM337-ADJ-NEG-VOLT-REG]
X1  16M Hz ±30ppm  [XTAL 16MHz SMD]
XFR1  PL30-12-130B  [TRANSFORMER-DUAL-PRIMARY]

### Nets
+2.5V: C4.1 C6.1 C16.1 C29.1 C44.1 C51.2 C58.1 C62.1 C75.1 C77.1 C79.2 C81.2 C82.2 C88.2 C91.2 C121.1 R5.2 R7.2 R13.1 R44.2 R82.2 R110.2 TP2V5.1(TP?) U1.4(V+) U2.6(V+) U3.4(V+) U5.6(V+) U7.4(V+) U10.4(V+) U11.6(V+) U12.8(V+) U13.4(V+) U15.8(V+) U16.6(V+) U17.8(V+) U18.8(V+) U20.2(VL) U20.10(EN) U23.4(V+) VR2.3(VOUT)
+5V: C3.1 C28.1 C33.1 C34.1 C35.1 C36.1 C65.1 C96.1 C103.1 C120.1 CON2.2 R3.2 R4.1 R34.1 R53.2 R57.1 R78.1 R131.1 R138.1 TP5V.1(TP?) U4.12(VDD) U6.14(VCC) U6.24(AVCC) U6.34(VCC) U6.42(AREF) U6.44(AVCC) U14.12(VDD) U19.12(VDD) U20.19(VCC) U21.12(VDD) VR1.3(VOUT)
-2.5V: C5.1 C13.2 C17.1 C30.1 C45.1 C59.1 C63.1 C72.2 C76.1 C78.1 C80.2 C83.2 C92.2 C101.2 C106.2 D3.2(K) R28.2 TP_-2V5.1(TP?) U1.13(V-) U2.2(V-) U3.13(V-) U5.2(V-) U7.13(V-) U10.13(V-) U11.2(V-) U12.7(V-) U13.13(V-) U15.7(V-) U16.2(V-) U17.7(V-) U18.7(V-) U23.13(V-) VR3.3(VOUT)
-5V: C24.2 C27.1 C64.1 C95.1 C102.1 D4.2(K) R36.2 TP-5V.1(TP?) U4.3(VSS) U14.3(VSS) U19.3(VSS) U21.3(VSS) VR4.3(VOUT)
GND: BOOT.1 BOOT.2 C1.2 C2.2 C3.2 C4.2 C5.2 C6.2 C7.2 C13.1 C16.2 C17.2 C18.1 C23.2 C24.1 C25.1 C26.1 C27.2 C28.2 C29.2 C30.2 C33.2 C34.2 C35.2 C36.2 C39.2 C40.2 C41.2 C44.2 C45.2 C48.2 C51.1 C58.2 C59.2 C62.2 C63.2 C64.2 C65.2 C67.2 C72.1 C75.2 C76.2 C77.2 C78.2 C79.1 C80.1 C81.1 C82.1 C83.1 C85.1 C88.1 C91.1 C92.1 C93.1 C94.1 C95.2 C96.2 C101.1 C102.2 C103.2 C104.1 C106.1 C120.2 C121.2 CN1.5 CON1.2 CON2.6 CON6.2 CON7.2 CON8.2 CON9.2 CON10.2 CON_FGND.1 D1.2(K) D2.2(K) R1.1 R2.1 R6.1 R8.1 R10.2 R11.1 R15.2 R18.2 R21.1 R24.2 R32.1 R33.1 R35.2 R39.1 R40.1 R45.1 R52.2 R56.2 R60.2 R86.2 R88.1 R91.1 R93.1 R94.1 R101.1 R106.1 R112.2 R115.2 R118.2 R127.2 R129.2 R132.1 R133.1 R140.1 R144.2 R145.2 R146.2 RESET.3 RESET.4 TP_GND.1(TP?) TP_GND2.1(TP?) TVS1.C TVS2.C TVS3.C TVS4.C U4.13(GND) U6.5(UGND) U6.15(GND) U6.23(GND) U6.35(GND) U6.43(GND) U12.2(DGND) U12.10(GRT) U12.11(GRT) U14.13(GND) U15.2(DGND) U15.10(GRT) U15.11(GRT) U17.2(DGND) U17.10(GRT) U17.11(GRT) U18.2(DGND) U18.10(GRT) U18.11(GRT) U19.13(GND) U20.11(GND) U21.13(GND) X1.2 X1.4 XFR1.9(Sec-) XFR1.10(Sec+)
VUSB: CN1.1 U6.2(UVCC) U6.7(VBUS)
+6.3V: C1.1 C2.1 C7.1 U22.4(+) VR1.1(VIN) VR2.1(VIN)
-6.3V: C18.2 C25.2 C26.2 U22.3(-) VR3.1(VIN) VR4.1(VIN)
BOOT: BOOT.3 BOOT.4 R57.2 R60.1 U6.33(PE2(~{HWB}))
BP_100k-250k_OUT_C1: C98.1 TP10.1(TP?) U10.10(OUTC) U10.11(-INC) U19.10(S2B)
BP_100k-250k_OUT_C2: C105.1 TP14.1(TP?) U13.10(OUTC) U13.11(-INC) U21.10(S2B)
BP_100k-250k_OUT_V1: C97.1 TP9.1(TP?) U10.6(-INB) U10.7(OUTB) U19.5(S1B)
BP_100k-250k_OUT_V2: C89.1 TP13.1(TP?) U13.6(-INB) U13.7(OUTB) U21.5(S1B)
CS0: TP_CS0.1(TP?) U6.8(PB0(SS/PCINT0)) U20.12(I/O_VCC8)
CS0_SHFTD: U12.4(~{CS}) U20.9(I/O_VL8)
CS1: TP_CS1.1(TP?) U6.28(PB4(PCINT4/ADC11)) U20.13(I/O_VCC7)
CS1_SHFTD: U15.4(~{CS}) U20.8(I/O_VL7)
CS2: TP_CS2.1(TP?) U6.29(PB5(PCINT5/OC1A/~{OC4B}/ADC12)) U20.16(I/O_VCC4)
CS2_SHFTD: U18.4(~{CS}) U20.5(I/O_VL4)
CS3: TP_CS3.1(TP?) U6.30(PB6(PCINT6/OC1B/OC4B/ADC13)) U20.17(I/O_VCC3)
CS3_SHFTD: U17.4(~{CS}) U20.4(I/O_VL3)
F_MCU_SEL0: TP_F0.1(TP?) U4.1(A0) U6.41(PF0(ADC0))
F_MCU_SEL1: TP_F1.1(TP?) U4.14(A1) U6.40(PF1(ADC1))
F_MCU_SEL2: TP_F2.1(TP?) U6.39(PF4(ADC4/TCK)) U19.1(A0)
F_MCU_SEL3: TP_F3.1(TP?) U6.38(PF5(ADC5/TMS)) U19.14(A1)
F_MCU_SEL4: TP_F4.1(TP?) U6.37(PF6(ADC6/TDO)) U21.1(A0)
F_MCU_SEL5: TP_F5.1(TP?) U6.36(PF7(ADC7/TDI)) U21.14(A1)
F_MCU_SEL6: TP_F6.1(TP?) U6.1(PE6(INT.6/AIN0)) U14.1(A0)
F_MCU_SEL7: TP_F7.1(TP?) U6.27(PD7(T0/OC4~{D}/ADC10)) U14.14(A1)
FILTER_IN1: C84.2 R122.2 U19.4(S1A)
FILTER_IN2: C90.2 R123.2 U19.11(S2A)
FILTER_IN_3: C73.2 R83.1 U21.4(S1A)
FILTER_IN_4: C100.2 R97.2 U21.11(S2A)
FILTER_OUT1: R128.2 TP17.1(TP?) U19.6(D1)
FILTER_OUT2: R126.2 TP8.1(TP?) U19.9(D2)
FILTER_OUT_3: R116.2 TP23.1(TP?) U21.6(D1)
FILTER_OUT_4: R113.2 TP21.1(TP?) U21.9(D2)
L: F1.2 F2.1 XFR1.1(Pri+)
MISO: CON2.1 TP_MISO.1(TP?) U6.11(PB3(PDO/PCINT3/MISO))
MOSI: CON2.4 TP_MOSI.1(TP?) U6.10(PB2(PDI/PCINT2/MOSI)) U20.14(I/O_VCC6)
MOSI_SHFTD: U12.5(SDI) U15.5(SDI) U17.5(SDI) U18.5(SDI) U20.7(I/O_VL6)
N: C23.1 CON_N1.1 XFR1.6(Pri-)
N2: C67.1 CON_N2.1
NOTCH_VOUT1: R12.2 R121.1 TP2.1(TP?) U3.15(-IND) U3.16(OUTD)
NOTCH_VOUT2: R46.2 R125.2 TP6.1(TP?) U7.15(-IND) U7.16(OUTD)
Notch_VOUT_3: R38.2 R76.1 TP7.1(TP?) U1.15(-IND) U1.16(OUTD)
NOTCH_VOUT_4: R102.2 R104.2 TP20.1(TP?) U23.15(-IND) U23.16(OUTD)
PB7: U6.12(PB7(PCINT7/OC0A/OC1C/~{RTS}))
PC6: U6.31(PC6(OC3A/~{OC4A}))
PC7: U6.32(PC7(ICP3/CLK0/OC4A))
PD2: U6.20(PD2(RXD1/INT2))
PD5: D_STAT3.1(A) U6.22(PD5(XCK1/~{CTS}))
PD6: D_STAT4.1(A) U6.26(PD6(T1/~{OC4D}/ADC9))
PRE_AMP_OUT1: R9.1 R120.2 TP1.1(TP?) U2.1(OUT) U4.4(S1A)
PRE_AMP_OUT2: R51.1 R124.2 TP4.1(TP?) U4.11(S2A) U5.1(OUT)
PRE_AMP_OUT_3: R37.2 R85.1 TP11.1(TP?) U11.1(OUT) U14.4(S1A)
PRE_AMP_OUT_4: R109.2 R111.1 TP18.1(TP?) U14.11(S2A) U16.1(OUT)
Reset: C40.1 CON2.5 R53.1 RESET.1 RESET.2 U6.13(~{RESET})
SCK: CON2.3 TP_SCK.1(TP?) U6.9(PB1(PCINT1/SCLK)) U20.15(I/O_VCC5)
SCK_SHFTD: U12.3(SCK) U15.3(SCK) U17.3(SCK) U18.3(SCK) U20.6(I/O_VL5)
SCL: TPSCL.1(TP?) U6.18(PD0(OC0B/SCL/INT0))
SDA: TPSDA.1(TP?) U6.19(PD1(SDA/INT1))
STAT1_LED: D_STAT1.1(A) U6.21(PD3(TXD1/INT3))
STAT2_LED: D_STAT2.1(A) U6.25(PD4(ICP1/ADC8))
VOLT_SIG: R27.2 R32.2 TP3.1(TP?) TVS2.A U2.3(IN+)
VOLT_SIG_2: R84.2 R93.2 TP16.1(TP?) TVS1.A U11.3(IN+)
NetC8_1: C8.1 C19.1 R31.1 R87.1 U23.10(OUTC) U23.11(-INC)
NetC8_2: C8.2 C19.2 R29.1 R30.2
NetC9_1: C9.1 C10.1 R22.1 R23.1 U3.6(-INB) U3.7(OUTB)
NetC9_2: C9.2 C10.2 R16.2 R17.1
NetC11_1: C11.1 C12.1 R25.1 R26.1 U3.10(OUTC) U3.11(-INC)
NetC11_2: C11.2 C12.2 R19.1 R20.2
NetC14_1: C14.1 C15.2 R22.2 R23.2
NetC14_2: C14.2 R16.1 R120.1
NetC15_1: C15.1 R17.2 U3.3(+INA)
NetC20_1: C20.1 R19.2 U3.14(+IND)
NetC20_2: C20.2 C21.1 R25.2 R26.2
NetC21_2: C21.2 R14.2 R20.1 U3.1(OUTA) U3.2(-INA)
NetC22_1: C22.1 F2.2
NetC22_2: C22.2 R27.1 R33.2
NetC31_1: C31.1 C32.1 R49.1 R50.1 U7.6(-INB) U7.7(OUTB)
NetC31_2: C31.2 C32.2 R41.2 R42.1
NetC37_1: C37.1 C38.2 R49.2 R50.2
NetC37_2: C37.2 R41.1 R124.1
NetC38_1: C38.1 R42.2 U7.3(+INA)
NetC39_1: C39.1 U6.16(XTAL2) X1.3
NetC41_1: C41.1 U6.17(XTAL1) X1.1
NetC42_1: C42.1 C43.1 R58.1 R59.1 U7.10(OUTC) U7.11(-INC)
NetC42_2: C42.2 C43.2 R54.1 R55.2
NetC46_1: C46.1 R54.2 U7.14(+IND)
NetC46_2: C46.2 C47.1 R58.2 R59.2
NetC47_2: C47.2 R48.2 R55.1 U7.1(OUTA) U7.2(-INA)
NetC48_1: C48.1 U6.6(UCAP)
NetC52_1: C52.1 C53.1 R75.1 R77.1 U1.6(-INB) U1.7(OUTB)
NetC52_2: C52.2 C53.2 R71.2 R72.1
NetC54_1: C54.1 C55.1 R79.1 R81.1 U1.10(OUTC) U1.11(-INC)
NetC54_2: C54.2 C55.2 R73.1 R74.2
NetC56_1: C56.1 C57.2 R75.2 R77.2
NetC56_2: C56.2 R37.1 R71.1
NetC57_1: C57.1 R72.2 U1.3(+INA)
NetC60_1: C60.1 R73.2 U1.14(+IND)
NetC60_2: C60.2 C61.1 R79.2 R81.2
NetC61_2: C61.2 R70.2 R74.1 U1.1(OUTA) U1.2(-INA)
NetC66_1: C66.1 F3.2
NetC66_2: C66.2 R84.1 R94.2
NetC68_1: C68.1 C69.1 R107.1 R108.1 U23.6(-INB) U23.7(OUTB)
NetC68_2: C68.2 C69.2 R99.2 R100.1
NetC70_1: C70.1 C71.2 R107.2 R108.2
NetC70_2: C70.2 R98.1 R99.1
NetC71_1: C71.1 R100.2 U23.3(+INA)
NetC73_1: C73.1 C74.2 R89.1
NetC74_1: C74.1 R91.2 U13.3(+INA)
NetC84_1: C84.1 C86.2 R119.1
NetC85_2: C85.2 R96.2 U13.5(+INB)
NetC86_1: C86.1 R132.2 U10.3(+INA)
NetC87_1: C87.1 R133.2 U10.14(+IND)
NetC87_2: C87.2 C90.1 R130.1
NetC89_2: C89.2 R95.2 R96.1
NetC93_2: C93.2 R135.2 U10.5(+INB)
NetC94_2: C94.2 R136.2 U10.12(+INC)
NetC97_2: C97.2 R134.2 R135.1
NetC98_2: C98.2 R136.1 R137.2
NetC99_1: C99.1 R140.2 U13.14(+IND)
NetC99_2: C99.2 C100.1 R139.1
NetC104_2: C104.2 R141.2 U13.12(+INC)
NetC105_2: C105.2 R141.1 R142.2
NetC107_1: C107.1 R29.2 U23.14(+IND)
NetC107_2: C107.2 C108.1 R31.2 R87.2
NetC108_2: C108.2 R30.1 R105.2 U23.1(OUTA) U23.2(-INA)
NetCN1_2: CN1.2 R43.1
NetCN1_3: CN1.3 R47.1
NetCON1_1: CON1.1 R106.2 TP19.1(TP?) TVS3.A U16.3(IN+)
NetCON6_1: CON6.1 R114.1 TP22.1(TP?)
NetCON7_1: CON7.1 R39.2 TP5.1(TP?) TVS4.A U5.3(IN+)
NetCON8_1: CON8.1 R80.1 TP26.1(TP?)
NetCON9_1: CON9.1 R103.1 TP27.1(TP?)
NetCON10_1: CON10.1 R117.1 TP34.1(TP?)
NetCON_L1_1: CON_L1.1 F1.1
NetCON_L2_1: CON_L2.1 F3.1
NetD1_1: D1.1(A) R3.1
NetD2_1: D2.1(A) R7.1
NetD3_1: D3.1(A) R15.1
NetD4_1: D4.1(A) R24.1
NetD_STAT1_2: D_STAT1.2(K) R56.1
NetD_STAT2_2: D_STAT2.2(K) R144.1
NetD_STAT3_2: D_STAT3.2(K) R145.1
NetD_STAT4_2: D_STAT4.2(K) R146.1
NetR1_2: R1.2 R38.1 U1.12(+INC)
NetR2_2: R2.2 R70.1 U1.5(+INB)
NetR4_2: R4.2 R6.2 VR1.2(ADJ)
NetR5_1: R5.1 U2.5(~{SHDN})
NetR8_2: R8.2 R12.1 U3.12(+INC)
NetR9_2: R9.2 R10.1 U2.4(IN-)
NetR11_2: R11.2 R14.1 U3.5(+INB)
NetR13_2: R13.2 R18.1 VR2.2(ADJ)
NetR21_2: R21.2 R28.1 VR3.2(ADJ)
NetR34_2: R34.2 U4.2(EN)
NetR35_1: R35.1 R36.1 VR4.2(ADJ)
NetR40_2: R40.2 R46.1 U7.12(+INC)
NetR43_2: R43.2 U6.3(D-)
NetR44_1: R44.1 U5.5(~{SHDN})
NetR45_2: R45.2 R48.1 U7.5(+INB)
NetR47_2: R47.2 U6.4(D+)
NetR51_2: R51.2 R52.1 U5.4(IN-)
NetR76_2: R76.2 U14.5(S1B)
NetR78_2: R78.2 U14.2(EN)
NetR80_2: R80.2 U12.13(VOUT)
NetR82_1: R82.1 U11.5(~{SHDN})
NetR83_2: R83.2 TP12.1(TP?) U14.6(D1)
NetR85_2: R85.2 R86.1 U11.4(IN-)
NetR88_2: R88.2 R104.1 U23.12(+INC)
NetR89_2: R89.2 R95.1 U13.1(OUTA) U13.2(-INA)
NetR97_1: R97.1 TP15.1(TP?) U14.9(D2)
NetR98_2: R98.2 R109.1
NetR101_2: R101.2 R105.1 U23.5(+INB)
NetR102_1: R102.1 U14.10(S2B)
NetR103_2: R103.2 U15.13(VOUT)
NetR110_1: R110.1 U16.5(~{SHDN})
NetR111_2: R111.2 R112.1 U16.4(IN-)
NetR113_1: R113.1 R115.1 U17.12(IN+)
NetR114_2: R114.2 U17.13(VOUT)
NetR116_1: R116.1 R118.1 U18.12(IN+)
NetR117_2: R117.2 U18.13(VOUT)
NetR119_2: R119.2 R134.1 U10.1(OUTA) U10.2(-INA)
NetR121_2: R121.2 U4.5(S1B)
NetR122_1: R122.1 TP24.1(TP?) U4.6(D1)
NetR123_1: R123.1 TP25.1(TP?) U4.9(D2)
NetR125_1: R125.1 U4.10(S2B)
NetR126_1: R126.1 R127.1 U12.12(IN+)
NetR128_1: R128.1 R129.1 U15.12(IN+)
NetR130_2: R130.2 R137.1 U10.15(-IND) U10.16(OUTD)
NetR131_2: R131.2 U19.2(EN)
NetR138_2: R138.2 U21.2(EN)
NetR139_2: R139.2 R142.1 U13.15(-IND) U13.16(OUTD)
NetU22_1: U22.1 XFR1.7(Sec+)
NetU22_2: U22.2 XFR1.12(Sec-)
NetXFR1_3: XFR1.3(Pri-) XFR1.4(Pri+)

Not connected (* = marked no-connect by the designer): CN1 4; U1 8(NC) 9(NC); U3 8(NC) 9(NC); U4 7(NC) 8(NC); U7 8(NC) 9(NC); U10 8(NC) 9(NC); U12 1(NC) 6(SDO) 9(NC) 14(NC); U13 8(NC) 9(NC); U14 7(NC) 8(NC); U15 1(NC) 6(SDO) 9(NC) 14(NC); U17 1(NC) 6(SDO) 9(NC) 14(NC); U18 1(NC) 6(SDO) 9(NC) 14(NC); U19 7(NC) 8(NC); U20 1(I/O_VL1) 3(I/O_VL2) 18(I/O_VCC2) 20(I/O_VCC1); U21 7(NC) 8(NC); U23 8(NC) 9(NC)

### Buses and harness runs
bus MOSI,SCK,CS[0..1]
bus MOSI,SCK,CS[0..1]_SHFTD
bus MOSI,SCK,CS[0..9]

### Notes on the sheet
- (near XFR1) Do not place part on BOM; use PL30-24-130B instead. Same family so same footprint!
- Default these to 0 Ohms
- Yellow 1
  blue     3
  black   5
  orange 2
  green   4
  red      6
- Place Near Pins 14,24,34,44
- Change R39 to 49.9Ohm for cost
- NC, Pull low to enable HW Bootloader
- R113 -> JC? 0 ohm
  R115->JO?
- BP 100k-250k
- R116 -> JC? (0 ohm)
  R118->JO?
- R126 -> JC? (0 ohm)
  R127->JO?
- R128 -> JC? (0 ohm)
  R129->JO?
- Wideband - AC EMI Monitor
- 20110512001
- 1
- 2
- H.Herman & V.Balakrishan
- C
- Labels drawn without touching a wire or pin: MOSI,SCK,CS[0..1], MOSI,SCK,CS[0..9]
- (in symbol 2191) -; +
- (in symbol 2192) +; -